# EAGLE schematic main (EAGLE 6.1), part 1 of 2
DATABASE: ./bom/volat3-PARTSDB.tsv
Assembly variants: oblick

## Sheet 1 of 11: mcu
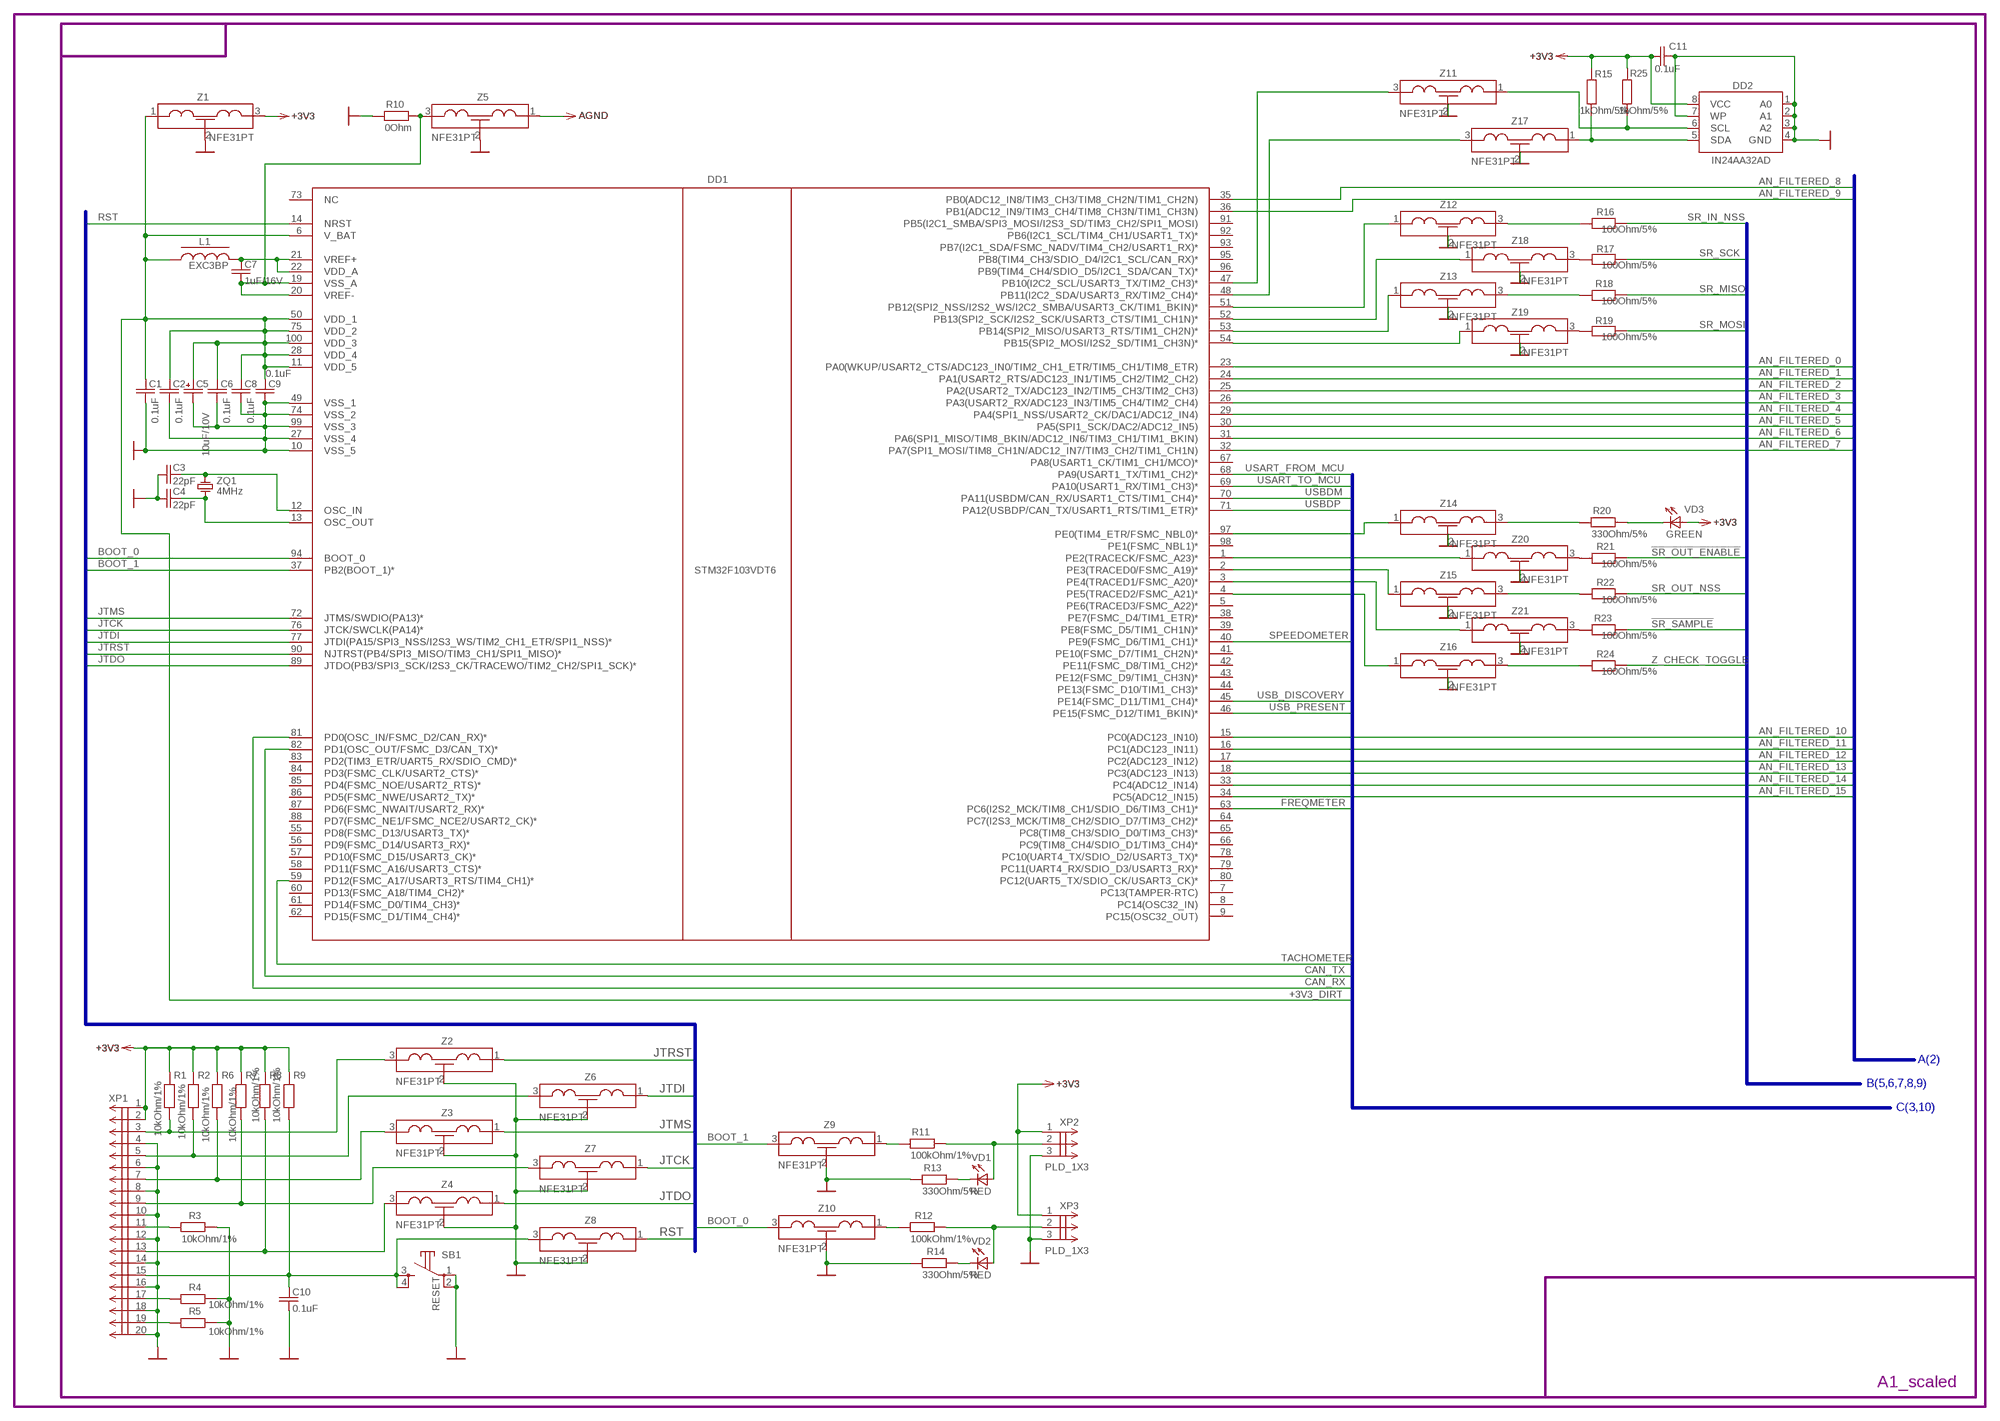
[diagram p0: schematic, sheet 1]

### Parts
C1  0.1uF  C-EUC0603  [C0603]
C2  0.1uF  C-EUC0603  [C0603]
C3  22pF  C-EUC0603  [C0603]
C4  22pF  C-EUC0603  [C0603]
C5  10uF/10V  CPOL-EUA/3216-18W  [A/3216-18W]
C6  0.1uF  C-EUC0603  [C0603]
C7  1uF/16V  C-EUC0603  [C0603]
C8  0.1uF  C-EUC0603  [C0603]
C9  0.1uF  C-EUC0603  [C0603]
C10  0.1uF  C-EUC0603  [C0603]
C11  0.1uF  C-EUC0603  [C0603]
DD1  STM32F103VDT6  [TQFP100]
DD2  IN24AA32AD  [SO08]
L1  EXC3BP  [L0603]
R1  10kOhm/1%  R-EU_R0603  [R0603]
R2  10kOhm/1%  R-EU_R0603  [R0603]
R3  10kOhm/1%  R-EU_R0603  [R0603]
R4  10kOhm/1%  R-EU_R0603  [R0603]
R5  10kOhm/1%  R-EU_R0603  [R0603]
R6  10kOhm/1%  R-EU_R0603  [R0603]
R7  10kOhm/1%  R-EU_R0603  [R0603]
R8  10kOhm/1%  R-EU_R0603  [R0603]
R9  10kOhm/1%  R-EU_R0603  [R0603]
R10  0Ohm  R-EU_R0805  [R0805]
R11  100kOhm/1%  R-EU_R0603  [R0603]
R12  100kOhm/1%  R-EU_R0603  [R0603]
R13  330Ohm/5%  R-EU_R0603  [R0603]
R14  330Ohm/5%  R-EU_R0603  [R0603]
R15  1kOhm/5%  R-EU_R0805  [R0805]
R16  100Ohm/5%  R-EU_R0603  [R0603]
R17  100Ohm/5%  R-EU_R0603  [R0603]
R18  100Ohm/5%  R-EU_R0603  [R0603]
R19  100Ohm/5%  R-EU_R0603  [R0603]
R20  330Ohm/5%  R-EU_R0603  [R0603]
R21  100Ohm/5%  R-EU_R0603  [R0603]
R22  100Ohm/5%  R-EU_R0603  [R0603]
R23  100Ohm/5%  R-EU_R0603  [R0603]
R24  100Ohm/5%  R-EU_R0603  [R0603]
R25  1kOhm/5%  R-EU_R0805  [R0805]
SB1  RESET  4-1437565-2  [B3S-10XX]
VD1  RED  LED0805  [LED-0805]
VD2  RED  LED0805  [LED-0805]
VD3  GREEN  LED0805  [LED-0805]
XP1  PLD_2X10-SHROUDED  [PLD_2X10_SHROUDED]
XP2  PLD_1X3  PLD_1X03  [PLD_1X03]
XP3  PLD_1X3  PLD_1X03  [PLD_1X03]
Z1  NFE31PT  [NFE31]
Z2  NFE31PT  [NFE31]
Z3  NFE31PT  [NFE31]
Z4  NFE31PT  [NFE31]
Z5  NFE31PT  [NFE31]
Z6  NFE31PT  [NFE31]
Z7  NFE31PT  [NFE31]
Z8  NFE31PT  [NFE31]
Z9  NFE31PT  [NFE31]
Z10  NFE31PT  [NFE31]
Z11  NFE31PT  [NFE31]
Z12  NFE31PT  [NFE31]
Z13  NFE31PT  [NFE31]
Z14  NFE31PT  [NFE31]
Z15  NFE31PT  [NFE31]
Z16  NFE31PT  [NFE31]
Z17  NFE31PT  [NFE31]
Z18  NFE31PT  [NFE31]
Z19  NFE31PT  [NFE31]
Z20  NFE31PT  [NFE31]
Z21  NFE31PT  [NFE31]
ZQ1  4MHz  CRYSTALHC49UV  [HC49U-V]

### Nets
!SR_OUT_ENABLE: R21.1 ; also sheet 9
!SR_SAMPLE: R23.1 ; also sheet 5,6,7,8
+3V3: C11.2 DD2.8(VCC) R1.2 R2.2 R6.2 R7.2 R8.2 R9.2 R15.1 R25.1 VD3.A XP1.1 XP1.2 XP2.1 XP3.1 Z1.3 ; also sheet 4,5,6,7,8,9,10
+3V3_DIRT: C1.1 C2.1 C5.+ C6.1 C8.1 C9.1 DD1.6(V_BAT) DD1.11(VDD_5) DD1.28(VDD_4) DD1.50(VDD_1) DD1.75(VDD_2) DD1.100(VDD_3) L1.1 Z1.1 ; also sheet 10
AGND: Z5.1 ; also sheet 2
AN_FILTERED_0: DD1.23(PA0(WKUP/USART2_CTS/ADC123_IN0/TIM2_CH1_ETR/TIM5_CH1/TIM8_ETR)) ; also sheet 2
AN_FILTERED_1: DD1.24(PA1(USART2_RTS/ADC123_IN1/TIM5_CH2/TIM2_CH2)) ; also sheet 2
AN_FILTERED_2: DD1.25(PA2(USART2_TX/ADC123_IN2/TIM5_CH3/TIM2_CH3)) ; also sheet 2
AN_FILTERED_3: DD1.26(PA3(USART2_RX/ADC123_IN3/TIM5_CH4/TIM2_CH4)) ; also sheet 2
AN_FILTERED_4: DD1.29(PA4(SPI1_NSS/USART2_CK/DAC1/ADC12_IN4)) ; also sheet 2
AN_FILTERED_5: DD1.30(PA5(SPI1_SCK/DAC2/ADC12_IN5)) ; also sheet 2
AN_FILTERED_6: DD1.31(PA6(SPI1_MISO/TIM8_BKIN/ADC12_IN6/TIM3_CH1/TIM1_BKIN)) ; also sheet 2
AN_FILTERED_7: DD1.32(PA7(SPI1_MOSI/TIM8_CH1N/ADC12_IN7/TIM3_CH2/TIM1_CH1N)) ; also sheet 2
AN_FILTERED_8: DD1.35(PB0(ADC12_IN8/TIM3_CH3/TIM8_CH2N/TIM1_CH2N)) ; also sheet 2
AN_FILTERED_9: DD1.36(PB1(ADC12_IN9/TIM3_CH4/TIM8_CH3N/TIM1_CH3N)) ; also sheet 2
AN_FILTERED_10: DD1.15(PC0(ADC123_IN10)) ; also sheet 2
AN_FILTERED_11: DD1.16(PC1(ADC123_IN11)) ; also sheet 2
AN_FILTERED_12: DD1.17(PC2(ADC123_IN12)) ; also sheet 2
AN_FILTERED_13: DD1.18(PC3(ADC123_IN13)) ; also sheet 2
AN_FILTERED_14: DD1.33(PC4(ADC12_IN14)) ; also sheet 2
AN_FILTERED_15: DD1.34(PC5(ADC12_IN15)) ; also sheet 2
BOOT_0: DD1.94(BOOT_0) Z10.3
BOOT_1: DD1.37(PB2(BOOT_1)*) Z9.3
CAN_RX: DD1.81(PD0(OSC_IN/FSMC_D2/CAN_RX)*) ; also sheet 10
CAN_TX: DD1.82(PD1(OSC_OUT/FSMC_D3/CAN_TX)*) ; also sheet 10
FREQMETER: DD1.63(PC6(I2S2_MCK/TIM8_CH1/SDIO_D6/TIM3_CH1)*) ; also sheet 3
GND: C1.2 C2.2 C3.2 C4.2 C5.- C6.2 C8.2 C9.2 C10.2 C11.1 DD1.10(VSS_5) DD1.27(VSS_4) DD1.49(VSS_1) DD1.74(VSS_2) DD1.99(VSS_3) DD2.1(A0) DD2.2(A1) DD2.3(A2) DD2.4(GND) DD2.7(WP) R3.2 R4.2 R5.2 R10.1 R13.1 R14.1 SB1.1 SB1.2 XP1.4 XP1.6 XP1.8 XP1.10 XP1.12 XP1.14 XP1.16 XP1.18 XP1.20 XP2.3 XP3.3 Z1.2 Z2.2 Z3.2 Z4.2 Z5.2 Z6.2 Z7.2 Z8.2 Z9.2 Z10.2 Z11.2 Z12.2 Z13.2 Z14.2 Z15.2 Z16.2 Z17.2 Z18.2 Z19.2 Z20.2 Z21.2 ; also sheet 2,3,4,5,6,7,8,9,10
I2C_SCL: DD1.47(PB10(I2C2_SCL/USART3_TX/TIM2_CH3)*) Z11.3
I2C_SDA: DD2.5(SDA) R15.2 Z17.1
JTCK: DD1.76(JTCK/SWCLK(PA14)*) Z7.1
JTDI: DD1.77(JTDI(PA15/SPI3_NSS/I2S3_WS/TIM2_CH1_ETR/SPI1_NSS)*) Z6.1
JTDO: DD1.89(JTDO(PB3/SPI3_SCK/I2S3_CK/TRACEWO/TIM2_CH2/SPI1_SCK)*) Z4.1
JTMS: DD1.72(JTMS/SWDIO(PA13)*) Z3.1
JTRST: DD1.90(NJTRST(PB4/SPI3_MISO/TIM3_CH1/SPI1_MISO)*) Z2.1
N$12: R5.1 XP1.19
N$13: R4.1 XP1.17
N$14: C4.1 DD1.13(OSC_OUT) ZQ1.1
N$15: C3.1 DD1.12(OSC_IN) ZQ1.2
N$16: DD1.51(PB12(SPI2_NSS/I2S2_WS/I2C2_SMBA/USART3_CK/TIM1_BKIN)*) Z12.1
N$17: R3.1 XP1.11
N$18: R12.2 VD2.A XP3.2
N$19: R11.2 VD1.A XP2.2
N$20: R13.2 VD1.C
N$220: DD1.52(PB13(SPI2_SCK/I2S2_SCK/USART3_CTS/TIM1_CH1N)*) Z18.1
N$221: DD1.53(PB14(SPI2_MISO/USART3_RTS/TIM1_CH2N)*) Z13.1
N$222: DD1.54(PB15(SPI2_MOSI/I2S2_SD/TIM1_CH3N)*) Z19.1
N$223: DD1.1(PE2(TRACECK/FSMC_A23)*) Z20.1
N$226: C7.1 DD1.21(VREF+) DD1.22(VDD_A) L1.2
N$232: R14.2 VD2.C
N$268: R20.2 VD3.C
N$272: R20.1 Z14.3
N$275: DD1.2(PE3(TRACED0/FSMC_A19)*) Z15.1
N$276: DD1.3(PE4(TRACED1/FSMC_A20)*) Z21.1
N$277: DD1.4(PE5(TRACED2/FSMC_A21)*) Z16.1
N$331: C7.2 DD1.19(VSS_A) DD1.20(VREF-) R10.2 Z5.3
N$332: R12.1 Z10.1
N$333: R11.1 Z9.1
N$334: R1.1 XP1.3 Z2.3
N$335: R2.1 XP1.5 Z6.3
N$336: R6.1 XP1.7 Z3.3
N$337: C10.1 R9.1 SB1.3 SB1.4 XP1.15 Z8.3
N$338: R7.1 XP1.9 Z7.3
N$339: R8.1 XP1.13 Z4.3
N$340: DD1.48(PB11(I2C2_SDA/USART3_RX/TIM2_CH4)*) Z17.3
N$341: DD2.6(SCL) R25.2 Z11.1
N$350: DD1.97(PE0(TIM4_ETR/FSMC_NBL0)*) Z14.1
N$351: R21.2 Z20.3
N$352: R22.2 Z15.3
N$353: R23.2 Z21.3
N$354: R24.2 Z16.3
N$355: R16.2 Z12.3
N$356: R18.2 Z13.3
N$357: R17.2 Z18.3
N$358: R19.2 Z19.3
RST: DD1.14(NRST) Z8.1
SPEEDOMETER: DD1.40(PE9(FSMC_D6/TIM1_CH1)*) ; also sheet 3
SR_IN_NSS: R16.1 ; also sheet 5,6,7,8
SR_MISO: R18.1 ; also sheet 8
SR_MOSI: R19.1 ; also sheet 9
SR_OUT_NSS: R22.1 ; also sheet 9
SR_SCK: R17.1 ; also sheet 5,6,7,8,9
TACHOMETER: DD1.59(PD12(FSMC_A17/USART3_RTS/TIM4_CH1)*) ; also sheet 3
USART_FROM_MCU: DD1.68(PA9(USART1_TX/TIM1_CH2)*) ; also sheet 10
USART_TO_MCU: DD1.69(PA10(USART1_RX/TIM1_CH3)*) ; also sheet 10
USB_DISCOVERY: DD1.45(PE14(FSMC_D11/TIM1_CH4)*) ; also sheet 10
USB_PRESENT: DD1.46(PE15(FSMC_D12/TIM1_BKIN)*) ; also sheet 10
USBDM: DD1.70(PA11(USBDM/CAN_RX/USART1_CTS/TIM1_CH4)*) ; also sheet 10
USBDP: DD1.71(PA12(USBDP/CAN_TX/USART1_RTS/TIM1_ETR)*) ; also sheet 10
Z_CHECK_TOGGLE: R24.1 ; also sheet 5
Unconnected: DD1.5(PE6(TRACED3/FSMC_A22)*) DD1.7(PC13(TAMPER-RTC)) DD1.8(PC14(OSC32_IN)) DD1.9(PC15(OSC32_OUT)) DD1.38(PE7(FSMC_D4/TIM1_ETR)*) DD1.39(PE8(FSMC_D5/TIM1_CH1N)*) DD1.41(PE10(FSMC_D7/TIM1_CH2N)*) DD1.42(PE11(FSMC_D8/TIM1_CH2)*) DD1.43(PE12(FSMC_D9/TIM1_CH3N)*) DD1.44(PE13(FSMC_D10/TIM1_CH3)*) DD1.55(PD8(FSMC_D13/USART3_TX)*) DD1.56(PD9(FSMC_D14/USART3_RX)*) DD1.57(PD10(FSMC_D15/USART3_CK)*) DD1.58(PD11(FSMC_A16/USART3_CTS)*) DD1.60(PD13(FSMC_A18/TIM4_CH2)*) DD1.61(PD14(FSMC_D0/TIM4_CH3)*) DD1.62(PD15(FSMC_D1/TIM4_CH4)*) DD1.64(PC7(I2S3_MCK/TIM8_CH2/SDIO_D7/TIM3_CH2)*) DD1.65(PC8(TIM8_CH3/SDIO_D0/TIM3_CH3)*) DD1.66(PC9(TIM8_CH4/SDIO_D1/TIM3_CH4)*) DD1.67(PA8(USART1_CK/TIM1_CH1/MCO)*) DD1.73(NC) DD1.78(PC10(UART4_TX/SDIO_D2/USART3_TX)*) DD1.79(PC11(UART4_RX/SDIO_D3/USART3_RX)*) DD1.80(PC12(UART5_TX/SDIO_CK/USART3_CK)*) DD1.83(PD2(TIM3_ETR/UART5_RX/SDIO_CMD)*) DD1.84(PD3(FSMC_CLK/USART2_CTS)*) DD1.85(PD4(FSMC_NOE/USART2_RTS)*) DD1.86(PD5(FSMC_NWE/USART2_TX)*) DD1.87(PD6(FSMC_NWAIT/USART2_RX)*) DD1.88(PD7(FSMC_NE1/FSMC_NCE2/USART2_CK)*) DD1.91(PB5(I2C1_SMBA/SPI3_MOSI/I2S3_SD/TIM3_CH2/SPI1_MOSI)) DD1.92(PB6(I2C1_SCL/TIM4_CH1/USART1_TX)*) DD1.93(PB7(I2C1_SDA/FSMC_NADV/TIM4_CH2/USART1_RX)*) DD1.95(PB8(TIM4_CH3/SDIO_D4/I2C1_SCL/CAN_RX)*) DD1.96(PB9(TIM4_CH4/SDIO_D5/I2C1_SDA/CAN_TX)*) DD1.98(PE1(FSMC_NBL1)*)

### Buses
AN_FILTERED_[0..15]
IO_EXPAND:SR_MISO,SR_MOSI,SR_SCK,!SR_SAMPLE,SR_IN_NSS,SR_OUT_NSS,!SR_OUT_ENABLE,SR_OUT_[1..7],Z_CHECK_TOGGLE,Z_CHECK
TACHOMETER,FREQMETER,SPEEDOMETER,USB_DISCOVERY,USB_PRESENT,USBDP,USBDM,USART_FROM_MCU,USART_TO_MCU,CAN_TX,CAN_RX,+3V3_DIRT
JTRST,JTDI,JTMS,JTCK,JTDO,RST,BOOT_0,BOOT_1

### Notes on the sheet
- A(2)
- B(5,6,7,8,9)
- C(3,10)

## Sheet 2 of 11: analog
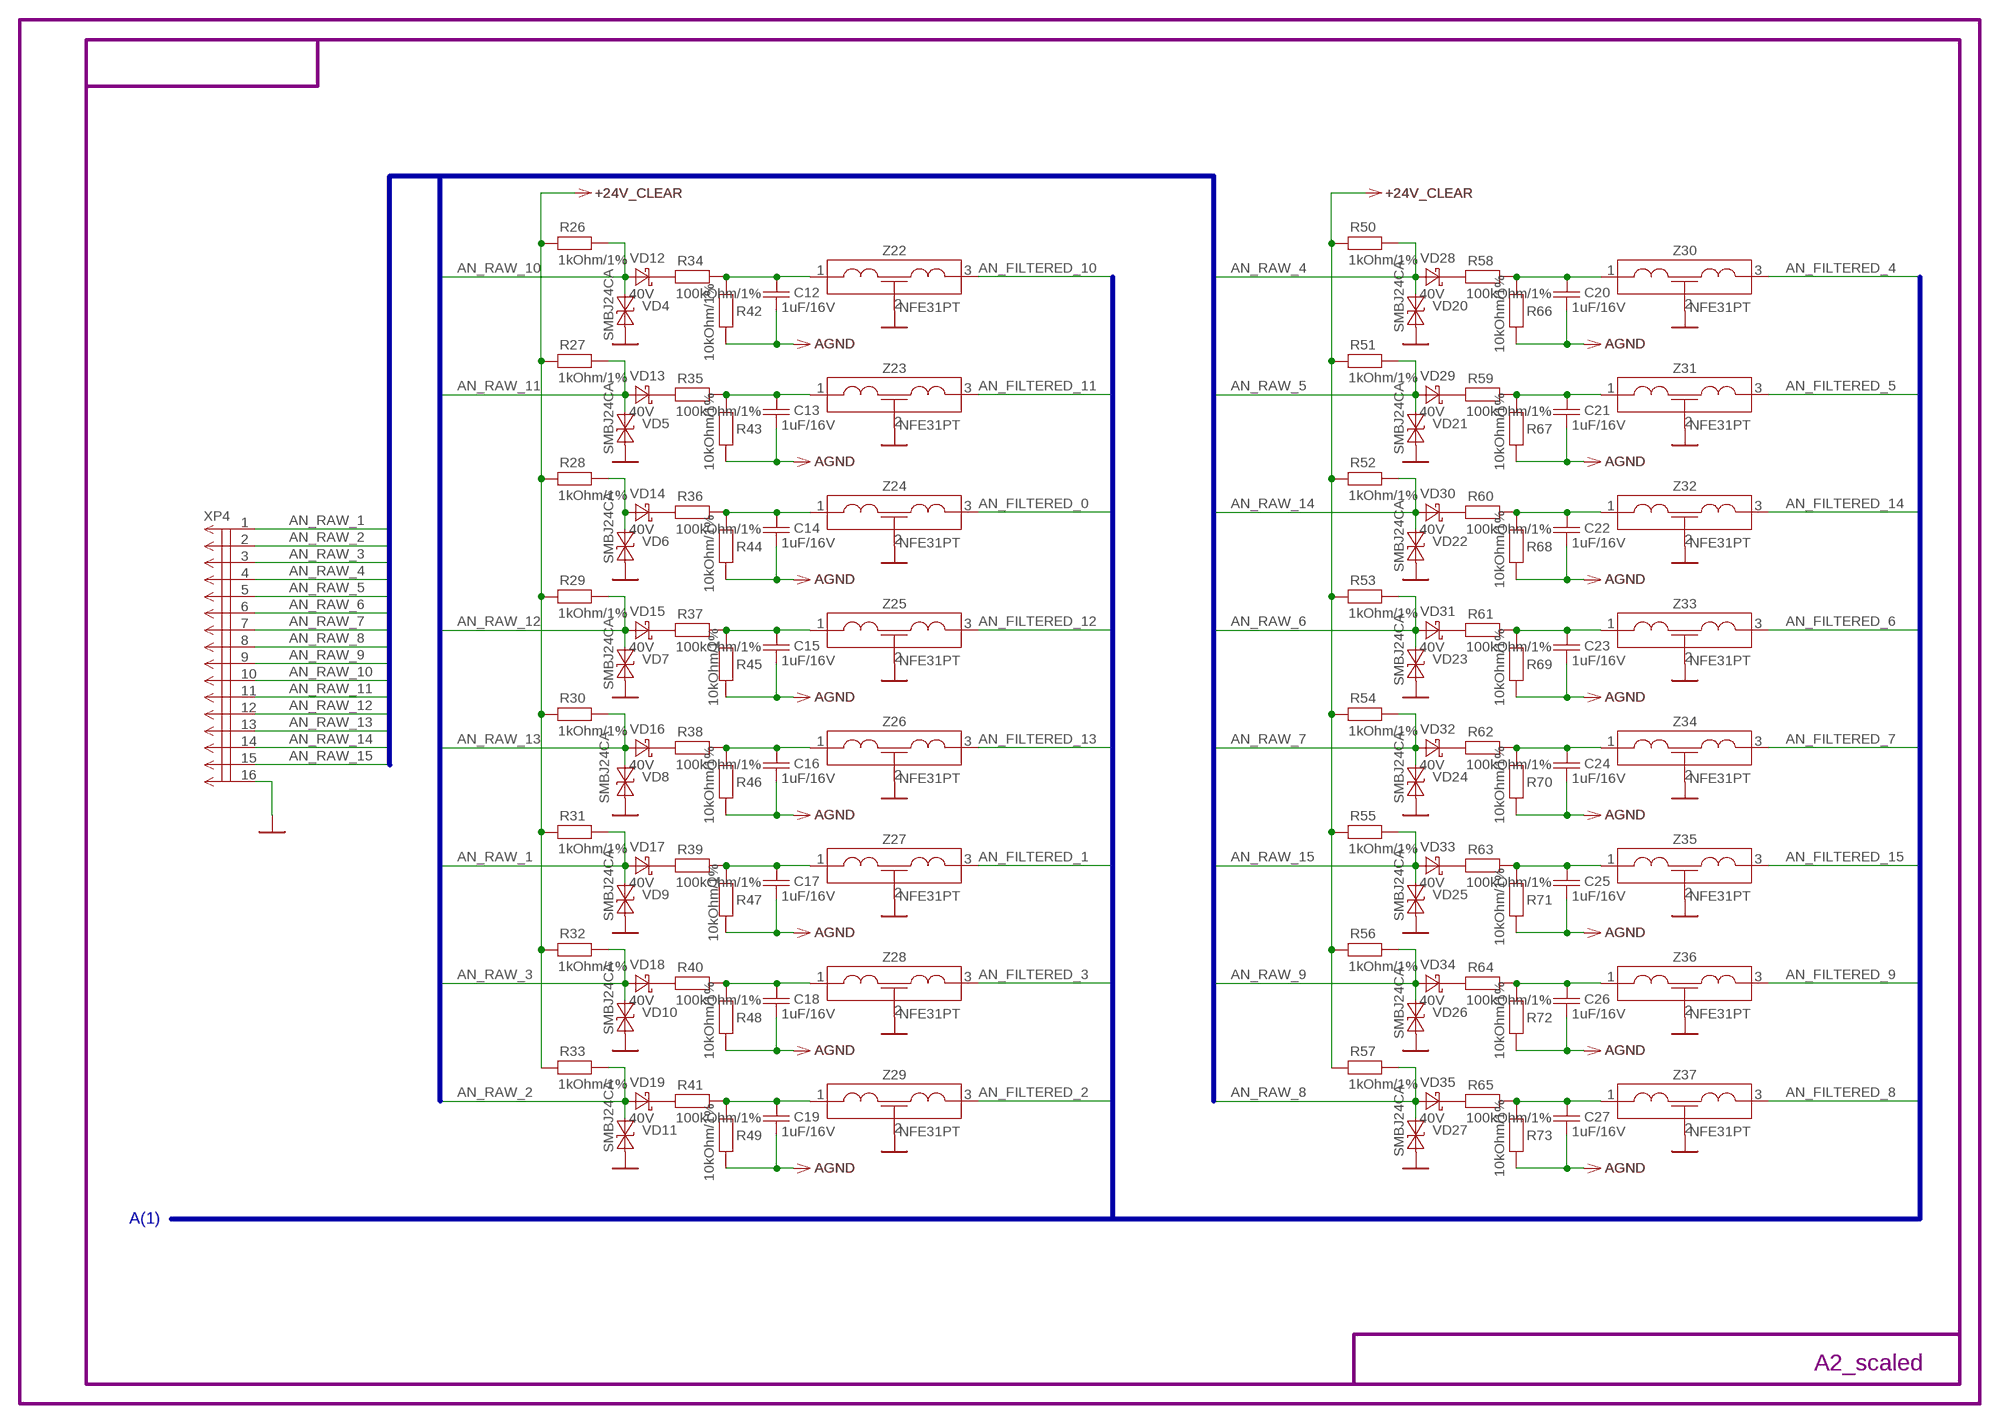
[diagram p1: schematic, sheet 2]

### Parts
C12  1uF/16V  C-EUC0603  [C0603]
C13  1uF/16V  C-EUC0603  [C0603]
C14  1uF/16V  C-EUC0603  [C0603]
C15  1uF/16V  C-EUC0603  [C0603]
C16  1uF/16V  C-EUC0603  [C0603]
C17  1uF/16V  C-EUC0603  [C0603]
C18  1uF/16V  C-EUC0603  [C0603]
C19  1uF/16V  C-EUC0603  [C0603]
C20  1uF/16V  C-EUC0603  [C0603]
C21  1uF/16V  C-EUC0603  [C0603]
C22  1uF/16V  C-EUC0603  [C0603]
C23  1uF/16V  C-EUC0603  [C0603]
C24  1uF/16V  C-EUC0603  [C0603]
C25  1uF/16V  C-EUC0603  [C0603]
C26  1uF/16V  C-EUC0603  [C0603]
C27  1uF/16V  C-EUC0603  [C0603]
R26  1kOhm/1%  R-EU_R2512  [R2512]
R27  1kOhm/1%  R-EU_R2512  [R2512]
R28  1kOhm/1%  R-EU_R2512  [R2512]
R29  1kOhm/1%  R-EU_R2512  [R2512]
R30  1kOhm/1%  R-EU_R2512  [R2512]
R31  1kOhm/1%  R-EU_R2512  [R2512]
R32  1kOhm/1%  R-EU_R2512  [R2512]
R33  1kOhm/1%  R-EU_R2512  [R2512]
R34  100kOhm/1%  R-EU_R0603  [R0603]
R35  100kOhm/1%  R-EU_R0603  [R0603]
R36  100kOhm/1%  R-EU_R0603  [R0603]
R37  100kOhm/1%  R-EU_R0603  [R0603]
R38  100kOhm/1%  R-EU_R0603  [R0603]
R39  100kOhm/1%  R-EU_R0603  [R0603]
R40  100kOhm/1%  R-EU_R0603  [R0603]
R41  100kOhm/1%  R-EU_R0603  [R0603]
R42  10kOhm/1%  R-EU_R0603  [R0603]
R43  10kOhm/1%  R-EU_R0603  [R0603]
R44  10kOhm/1%  R-EU_R0603  [R0603]
R45  10kOhm/1%  R-EU_R0603  [R0603]
R46  10kOhm/1%  R-EU_R0603  [R0603]
R47  10kOhm/1%  R-EU_R0603  [R0603]
R48  10kOhm/1%  R-EU_R0603  [R0603]
R49  10kOhm/1%  R-EU_R0603  [R0603]
R50  1kOhm/1%  R-EU_R2512  [R2512]
R51  1kOhm/1%  R-EU_R2512  [R2512]
R52  1kOhm/1%  R-EU_R2512  [R2512]
R53  1kOhm/1%  R-EU_R2512  [R2512]
R54  1kOhm/1%  R-EU_R2512  [R2512]
R55  1kOhm/1%  R-EU_R2512  [R2512]
R56  1kOhm/1%  R-EU_R2512  [R2512]
R57  1kOhm/1%  R-EU_R2512  [R2512]
R58  100kOhm/1%  R-EU_R0603  [R0603]
R59  100kOhm/1%  R-EU_R0603  [R0603]
R60  100kOhm/1%  R-EU_R0603  [R0603]
R61  100kOhm/1%  R-EU_R0603  [R0603]
R62  100kOhm/1%  R-EU_R0603  [R0603]
R63  100kOhm/1%  R-EU_R0603  [R0603]
R64  100kOhm/1%  R-EU_R0603  [R0603]
R65  100kOhm/1%  R-EU_R0603  [R0603]
R66  10kOhm/1%  R-EU_R0603  [R0603]
R67  10kOhm/1%  R-EU_R0603  [R0603]
R68  10kOhm/1%  R-EU_R0603  [R0603]
R69  10kOhm/1%  R-EU_R0603  [R0603]
R70  10kOhm/1%  R-EU_R0603  [R0603]
R71  10kOhm/1%  R-EU_R0603  [R0603]
R72  10kOhm/1%  R-EU_R0603  [R0603]
R73  10kOhm/1%  R-EU_R0603  [R0603]
VD4  SMBJ24CA  DIODE-TVS-BIDIR-SMB  [SMB-BIDIR]
VD5  SMBJ24CA  DIODE-TVS-BIDIR-SMB  [SMB-BIDIR]
VD6  SMBJ24CA  DIODE-TVS-BIDIR-SMB  [SMB-BIDIR]
VD7  SMBJ24CA  DIODE-TVS-BIDIR-SMB  [SMB-BIDIR]
VD8  SMBJ24CA  DIODE-TVS-BIDIR-SMB  [SMB-BIDIR]
VD9  SMBJ24CA  DIODE-TVS-BIDIR-SMB  [SMB-BIDIR]
VD10  SMBJ24CA  DIODE-TVS-BIDIR-SMB  [SMB-BIDIR]
VD11  SMBJ24CA  DIODE-TVS-BIDIR-SMB  [SMB-BIDIR]
VD12  40V  DIODE-SCHOTTKY-SOD323  [SOD323]
VD13  40V  DIODE-SCHOTTKY-SOD323  [SOD323]
VD14  40V  DIODE-SCHOTTKY-SOD323  [SOD323]
VD15  40V  DIODE-SCHOTTKY-SOD323  [SOD323]
VD16  40V  DIODE-SCHOTTKY-SOD323  [SOD323]
VD17  40V  DIODE-SCHOTTKY-SOD323  [SOD323]
VD18  40V  DIODE-SCHOTTKY-SOD323  [SOD323]
VD19  40V  DIODE-SCHOTTKY-SOD323  [SOD323]
VD20  SMBJ24CA  DIODE-TVS-BIDIR-SMB  [SMB-BIDIR]
VD21  SMBJ24CA  DIODE-TVS-BIDIR-SMB  [SMB-BIDIR]
VD22  SMBJ24CA  DIODE-TVS-BIDIR-SMB  [SMB-BIDIR]
VD23  SMBJ24CA  DIODE-TVS-BIDIR-SMB  [SMB-BIDIR]
VD24  SMBJ24CA  DIODE-TVS-BIDIR-SMB  [SMB-BIDIR]
VD25  SMBJ24CA  DIODE-TVS-BIDIR-SMB  [SMB-BIDIR]
VD26  SMBJ24CA  DIODE-TVS-BIDIR-SMB  [SMB-BIDIR]
VD27  SMBJ24CA  DIODE-TVS-BIDIR-SMB  [SMB-BIDIR]
VD28  40V  DIODE-SCHOTTKY-SOD323  [SOD323]
VD29  40V  DIODE-SCHOTTKY-SOD323  [SOD323]
VD30  40V  DIODE-SCHOTTKY-SOD323  [SOD323]
VD31  40V  DIODE-SCHOTTKY-SOD323  [SOD323]
VD32  40V  DIODE-SCHOTTKY-SOD323  [SOD323]
VD33  40V  DIODE-SCHOTTKY-SOD323  [SOD323]
VD34  40V  DIODE-SCHOTTKY-SOD323  [SOD323]
VD35  40V  DIODE-SCHOTTKY-SOD323  [SOD323]
XP4  MOLEX-90130-16  [MOLEX-90130-16]
Z22  NFE31PT  [NFE31]
Z23  NFE31PT  [NFE31]
Z24  NFE31PT  [NFE31]
Z25  NFE31PT  [NFE31]
Z26  NFE31PT  [NFE31]
Z27  NFE31PT  [NFE31]
Z28  NFE31PT  [NFE31]
Z29  NFE31PT  [NFE31]
Z30  NFE31PT  [NFE31]
Z31  NFE31PT  [NFE31]
Z32  NFE31PT  [NFE31]
Z33  NFE31PT  [NFE31]
Z34  NFE31PT  [NFE31]
Z35  NFE31PT  [NFE31]
Z36  NFE31PT  [NFE31]
Z37  NFE31PT  [NFE31]

### Nets
+24V_CLEAR: R26.1 R27.1 R28.1 R29.1 R30.1 R31.1 R32.1 R33.1 R50.1 R51.1 R52.1 R53.1 R54.1 R55.1 R56.1 R57.1 ; also sheet 4,5
AGND: C12.2 C13.2 C14.2 C15.2 C16.2 C17.2 C18.2 C19.2 C20.2 C21.2 C22.2 C23.2 C24.2 C25.2 C26.2 C27.2 R42.1 R43.1 R44.1 R45.1 R46.1 R47.1 R48.1 R49.1 R66.1 R67.1 R68.1 R69.1 R70.1 R71.1 R72.1 R73.1 ; also sheet 1
AN_FILTERED_0: Z24.3 ; also sheet 1
AN_FILTERED_1: Z27.3 ; also sheet 1
AN_FILTERED_2: Z29.3 ; also sheet 1
AN_FILTERED_3: Z28.3 ; also sheet 1
AN_FILTERED_4: Z30.3 ; also sheet 1
AN_FILTERED_5: Z31.3 ; also sheet 1
AN_FILTERED_6: Z33.3 ; also sheet 1
AN_FILTERED_7: Z34.3 ; also sheet 1
AN_FILTERED_8: Z37.3 ; also sheet 1
AN_FILTERED_9: Z36.3 ; also sheet 1
AN_FILTERED_10: Z22.3 ; also sheet 1
AN_FILTERED_11: Z23.3 ; also sheet 1
AN_FILTERED_12: Z25.3 ; also sheet 1
AN_FILTERED_13: Z26.3 ; also sheet 1
AN_FILTERED_14: Z32.3 ; also sheet 1
AN_FILTERED_15: Z35.3 ; also sheet 1
AN_RAW_1: R31.2 VD9.A1 VD17.A XP4.1
AN_RAW_2: R33.2 VD11.A1 VD19.A XP4.2
AN_RAW_2_SUPPLY: R28.2 VD6.A1 VD14.A
AN_RAW_3: R32.2 VD10.A1 VD18.A XP4.3
AN_RAW_4: R50.2 VD20.A1 VD28.A XP4.4
AN_RAW_5: R51.2 VD21.A1 VD29.A XP4.5
AN_RAW_6: R53.2 VD23.A1 VD31.A XP4.6
AN_RAW_7: R54.2 VD24.A1 VD32.A XP4.7
AN_RAW_8: R57.2 VD27.A1 VD35.A XP4.8
AN_RAW_9: R56.2 VD26.A1 VD34.A XP4.9
AN_RAW_10: R26.2 VD4.A1 VD12.A XP4.10
AN_RAW_11: R27.2 VD5.A1 VD13.A XP4.11
AN_RAW_12: R29.2 VD7.A1 VD15.A XP4.12
AN_RAW_13: R30.2 VD8.A1 VD16.A XP4.13
AN_RAW_14: R52.2 VD22.A1 VD30.A XP4.14
AN_RAW_15: R55.2 VD25.A1 VD33.A XP4.15
GND: VD4.A2 VD5.A2 VD6.A2 VD7.A2 VD8.A2 VD9.A2 VD10.A2 VD11.A2 VD20.A2 VD21.A2 VD22.A2 VD23.A2 VD24.A2 VD25.A2 VD26.A2 VD27.A2 XP4.16 Z22.2 Z23.2 Z24.2 Z25.2 Z26.2 Z27.2 Z28.2 Z29.2 Z30.2 Z31.2 Z32.2 Z33.2 Z34.2 Z35.2 Z36.2 Z37.2 ; also sheet 1,3,4,5,6,7,8,9,10
N$30: R34.1 VD12.C
N$31: R35.1 VD13.C
N$32: R41.1 VD19.C
N$33: R40.1 VD18.C
N$34: R39.1 VD17.C
N$35: R38.1 VD16.C
N$36: R37.1 VD15.C
N$37: R36.1 VD14.C
N$38: R58.1 VD28.C
N$39: R60.1 VD30.C
N$40: R59.1 VD29.C
N$41: R61.1 VD31.C
N$42: R62.1 VD32.C
N$43: R64.1 VD34.C
N$44: R63.1 VD33.C
N$45: R65.1 VD35.C
N$315: C12.1 R34.2 R42.2 Z22.1
N$316: C13.1 R35.2 R43.2 Z23.1
N$317: C14.1 R36.2 R44.2 Z24.1
N$318: C15.1 R37.2 R45.2 Z25.1
N$319: C16.1 R38.2 R46.2 Z26.1
N$320: C17.1 R39.2 R47.2 Z27.1
N$321: C18.1 R40.2 R48.2 Z28.1
N$322: C19.1 R41.2 R49.2 Z29.1
N$323: C20.1 R58.2 R66.2 Z30.1
N$324: C21.1 R59.2 R67.2 Z31.1
N$325: C22.1 R60.2 R68.2 Z32.1
N$326: C23.1 R61.2 R69.2 Z33.1
N$327: C24.1 R62.2 R70.2 Z34.1
N$328: C25.1 R63.2 R71.2 Z35.1
N$329: C26.1 R64.2 R72.2 Z36.1
N$330: C27.1 R65.2 R73.2 Z37.1

### Buses
AN_FILTERED_[0..15]
AN_RAW_[0..15]

### Notes on the sheet
- A(1)

## Sheet 3 of 11: Freq
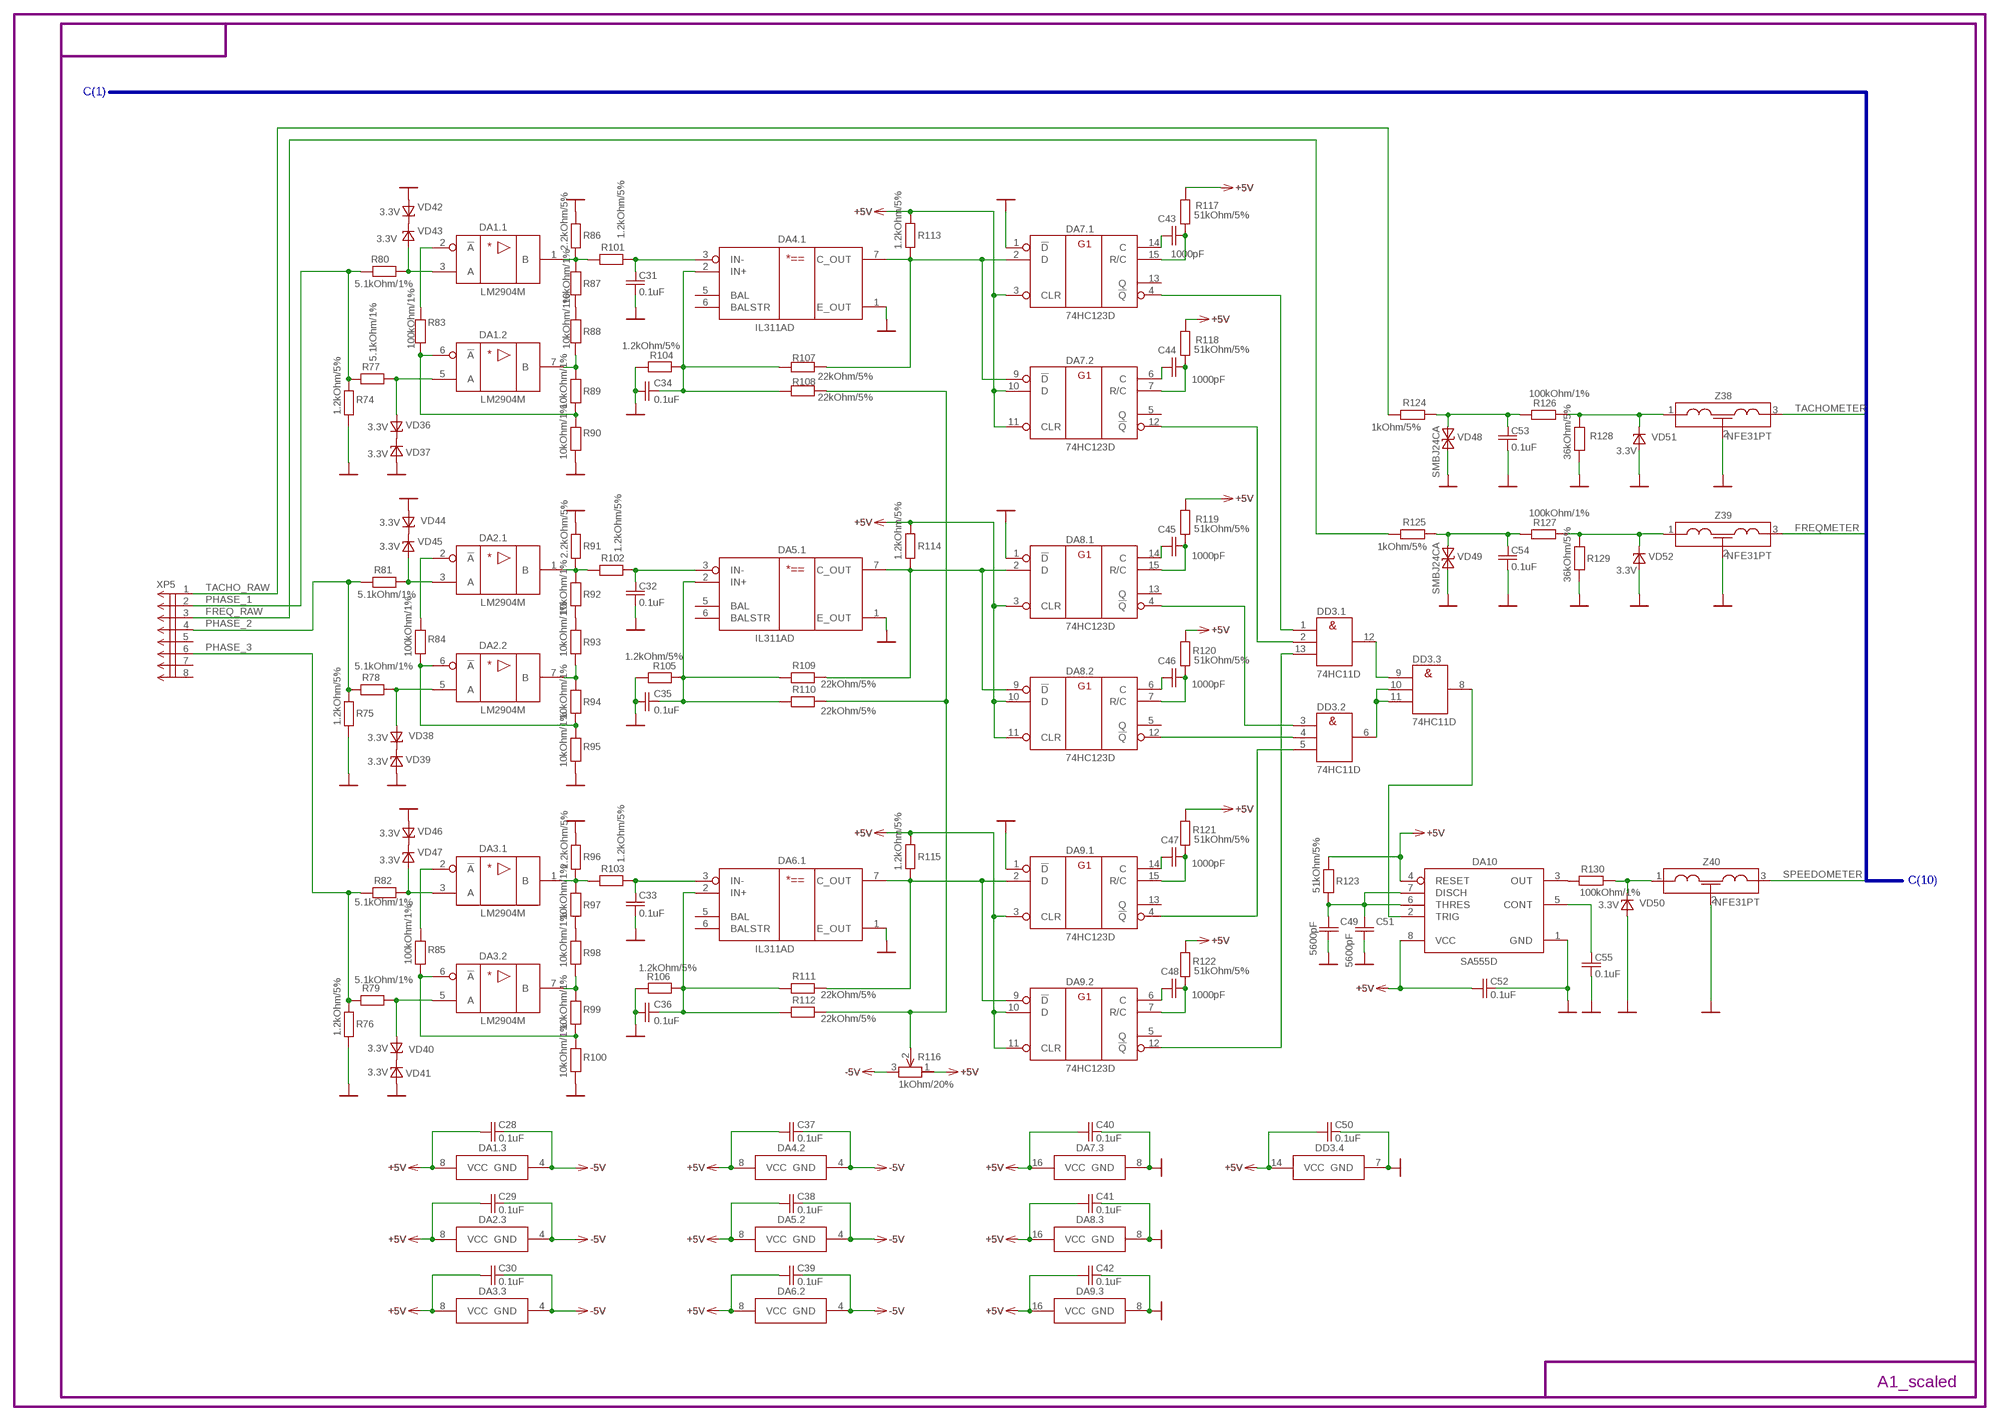
[diagram p2: schematic, sheet 3]

### Parts
C28  0.1uF  C-EUC0603  [C0603]
C29  0.1uF  C-EUC0603  [C0603]
C30  0.1uF  C-EUC0603  [C0603]
C31  0.1uF  C-EUC0603  [C0603]
C32  0.1uF  C-EUC0603  [C0603]
C33  0.1uF  C-EUC0603  [C0603]
C34  0.1uF  C-EUC0603  [C0603]
C35  0.1uF  C-EUC0603  [C0603]
C36  0.1uF  C-EUC0603  [C0603]
C37  0.1uF  C-EUC0603  [C0603]
C38  0.1uF  C-EUC0603  [C0603]
C39  0.1uF  C-EUC0603  [C0603]
C40  0.1uF  C-EUC0603  [C0603]
C41  0.1uF  C-EUC0603  [C0603]
C42  0.1uF  C-EUC0603  [C0603]
C43  1000pF  C-EUC0603  [C0603]
C44  1000pF  C-EUC0603  [C0603]
C45  1000pF  C-EUC0603  [C0603]
C46  1000pF  C-EUC0603  [C0603]
C47  1000pF  C-EUC0603  [C0603]
C48  1000pF  C-EUC0603  [C0603]
C49  5600pF  C-EUC0603  [C0603]
C50  0.1uF  C-EUC0603  [C0603]
C51  5600pF  C-EUC0603  [C0603]
C52  0.1uF  C-EUC0603  [C0603]
C53  0.1uF  C-EUC0603  [C0603]
C54  0.1uF  C-EUC0603  [C0603]
C55  0.1uF  C-EUC0603  [C0603]
DA1  LM2904M  [SO08]
DA2  LM2904M  [SO08]
DA3  LM2904M  [SO08]
DA4  IL311AD  [SO08]
DA5  IL311AD  [SO08]
DA6  IL311AD  [SO08]
DA7  74HC123D  [SO16]
DA8  74HC123D  [SO16]
DA9  74HC123D  [SO16]
DA10  SA555D  [SO08]
DD3  74HC11D  [SO14]
R74  1.2kOhm/5%  R-EU_R0603  [R0603]
R75  1.2kOhm/5%  R-EU_R0603  [R0603]
R76  1.2kOhm/5%  R-EU_R0603  [R0603]
R77  5.1kOhm/1%  R-EU_R0603  [R0603]
R78  5.1kOhm/1%  R-EU_R0603  [R0603]
R79  5.1kOhm/1%  R-EU_R0603  [R0603]
R80  5.1kOhm/1%  R-EU_R0603  [R0603]
R81  5.1kOhm/1%  R-EU_R0603  [R0603]
R82  5.1kOhm/1%  R-EU_R0603  [R0603]
R83  100kOhm/1%  R-EU_R0603  [R0603]
R84  100kOhm/1%  R-EU_R0603  [R0603]
R85  100kOhm/1%  R-EU_R0603  [R0603]
R86  2.2kOhm/5%  R-EU_R0603  [R0603]
R87  10kOhm/1%  R-EU_R0603  [R0603]
R88  10kOhm/1%  R-EU_R0603  [R0603]
R89  10kOhm/1%  R-EU_R0603  [R0603]
R90  10kOhm/1%  R-EU_R0603  [R0603]
R91  2.2kOhm/5%  R-EU_R0603  [R0603]
R92  10kOhm/1%  R-EU_R0603  [R0603]
R93  10kOhm/1%  R-EU_R0603  [R0603]
R94  10kOhm/1%  R-EU_R0603  [R0603]
R95  10kOhm/1%  R-EU_R0603  [R0603]
R96  2.2kOhm/5%  R-EU_R0603  [R0603]
R97  10kOhm/1%  R-EU_R0603  [R0603]
R98  10kOhm/1%  R-EU_R0603  [R0603]
R99  10kOhm/1%  R-EU_R0603  [R0603]
R100  10kOhm/1%  R-EU_R0603  [R0603]
R101  1.2kOhm/5%  R-EU_R0603  [R0603]
R102  1.2kOhm/5%  R-EU_R0603  [R0603]
R103  1.2kOhm/5%  R-EU_R0603  [R0603]
R104  1.2kOhm/5%  R-EU_R0603  [R0603]
R105  1.2kOhm/5%  R-EU_R0603  [R0603]
R106  1.2kOhm/5%  R-EU_R0603  [R0603]
R107  22kOhm/5%  R-EU_R0603  [R0603]
R108  22kOhm/5%  R-EU_R0603  [R0603]
R109  22kOhm/5%  R-EU_R0603  [R0603]
R110  22kOhm/5%  R-EU_R0603  [R0603]
R111  22kOhm/5%  R-EU_R0603  [R0603]
R112  22kOhm/5%  R-EU_R0603  [R0603]
R113  1.2kOhm/5%  R-EU_R0603  [R0603]
R114  1.2kOhm/5%  R-EU_R0603  [R0603]
R115  1.2kOhm/5%  R-EU_R0603  [R0603]
R116  1kOhm/20%  R-TRIMMTSM4YJ  [RTRIMTSM53YJ]
R117  51kOhm/5%  R-EU_R0603  [R0603]
R118  51kOhm/5%  R-EU_R0603  [R0603]
R119  51kOhm/5%  R-EU_R0603  [R0603]
R120  51kOhm/5%  R-EU_R0603  [R0603]
R121  51kOhm/5%  R-EU_R0603  [R0603]
R122  51kOhm/5%  R-EU_R0603  [R0603]
R123  51kOhm/5%  R-EU_R0603  [R0603]
R124  1kOhm/5%  R-EU_R2512  [R2512]
R125  1kOhm/5%  R-EU_R2512  [R2512]
R126  100kOhm/1%  R-EU_R0603  [R0603]
R127  100kOhm/1%  R-EU_R0603  [R0603]
R128  36kOhm/5%  R-EU_R0603  [R0603]
R129  36kOhm/5%  R-EU_R0603  [R0603]
R130  100kOhm/1%  R-EU_R0603  [R0603]
VD36  3.3V  DIODE-ZENER-  [SOD80]
VD37  3.3V  DIODE-ZENER-  [SOD80]
VD38  3.3V  DIODE-ZENER-  [SOD80]
VD39  3.3V  DIODE-ZENER-  [SOD80]
VD40  3.3V  DIODE-ZENER-  [SOD80]
VD41  3.3V  DIODE-ZENER-  [SOD80]
VD42  3.3V  DIODE-ZENER-  [SOD80]
VD43  3.3V  DIODE-ZENER-  [SOD80]
VD44  3.3V  DIODE-ZENER-  [SOD80]
VD45  3.3V  DIODE-ZENER-  [SOD80]
VD46  3.3V  DIODE-ZENER-  [SOD80]
VD47  3.3V  DIODE-ZENER-  [SOD80]
VD48  SMBJ24CA  DIODE-TVS-BIDIR-SMB  [SMB-BIDIR]
VD49  SMBJ24CA  DIODE-TVS-BIDIR-SMB  [SMB-BIDIR]
VD50  3.3V  DIODE-ZENER-  [SOD80]
VD51  3.3V  DIODE-ZENER-  [SOD80]
VD52  3.3V  DIODE-ZENER-  [SOD80]
XP5  MOLEX-90130-08  [MOLEX-90130-08]
Z38  NFE31PT  [NFE31]
Z39  NFE31PT  [NFE31]
Z40  NFE31PT  [NFE31]

### Nets
+5V: C28.1 C29.1 C30.1 C37.1 C38.1 C39.1 C40.1 C41.1 C42.1 C50.1 C52.1 DA1.8(.3:VCC) DA2.8(.3:VCC) DA3.8(.3:VCC) DA4.8(.2:VCC) DA5.8(.2:VCC) DA6.8(.2:VCC) DA7.3(.1:CLR) DA7.10(.2:D) DA7.11(.2:CLR) DA7.16(.3:VCC) DA8.3(.1:CLR) DA8.10(.2:D) DA8.11(.2:CLR) DA8.16(.3:VCC) DA9.3(.1:CLR) DA9.10(.2:D) DA9.11(.2:CLR) DA9.16(.3:VCC) DA10.4(RESET) DA10.8(VCC) DD3.14(.4:VCC) R113.1 R114.1 R115.1 R116.1(A) R117.2 R118.2 R119.2 R120.2 R121.2 R122.2 R123.2 ; also sheet 4
-5V: C28.2 C29.2 C30.2 C37.2 C38.2 C39.2 DA1.4(.3:GND) DA2.4(.3:GND) DA3.4(.3:GND) DA4.4(.2:GND) DA5.4(.2:GND) DA6.4(.2:GND) R116.3(E) ; also sheet 4
FREQ_RAW: R125.2 XP5.3
FREQMETER: Z39.3 ; also sheet 1
GND: C31.1 C32.1 C33.1 C34.2 C35.2 C36.2 C40.2 C41.2 C42.2 C49.2 C50.2 C51.2 C52.2 C53.1 C54.1 C55.2 DA4.1(.1:E_OUT) DA5.1(.1:E_OUT) DA6.1(.1:E_OUT) DA7.1(.1:!D) DA7.8(.3:GND) DA8.1(.1:!D) DA8.8(.3:GND) DA9.1(.1:!D) DA9.8(.3:GND) DA10.1(GND) DD3.7(.4:GND) R74.1 R75.1 R76.1 R86.2 R90.1 R91.2 R95.1 R96.2 R100.1 R104.2 R105.2 R106.2 R128.1 R129.1 VD37.A VD39.A VD41.A VD42.A VD44.A VD46.A VD48.A2 VD49.A2 VD50.A VD51.A VD52.A Z38.2 Z39.2 Z40.2 ; also sheet 1,2,4,5,6,7,8,9,10
N$87: VD44.C VD45.C
N$243: C53.2 R124.1 R126.1 VD48.A1
N$245: DD3.6(.2:Y) DD3.10(.3:B) DD3.11(.3:C)
N$246: DD3.9(.3:A) DD3.12(.1:Y)
N$247: DA10.2(TRIG) DD3.8(.3:Y)
N$248: DA10.3(OUT) R130.1
N$249: C34.1 DA4.2(.1:IN+) R104.1 R107.1 R108.1
N$250: DA4.7(.1:C_OUT) DA7.2(.1:D) DA7.9(.2:!D) R107.2 R113.2
N$251: VD42.C VD43.C
N$252: DA1.3(.1:A) R80.2 VD43.A
N$253: C43.2 DA7.15(.1:R/C) R117.1
N$254: DA2.3(.1:A) R81.2 VD45.A
N$255: VD36.C VD37.C
N$256: DA1.5(.2:A) R77.2 VD36.A
N$257: C43.1 DA7.14(.1:C)
N$258: C44.1 DA7.6(.2:C)
N$259: C31.2 DA4.3(.1:IN-) R101.2
N$260: C44.2 DA7.7(.2:R/C) R118.1
N$261: C49.1 C51.1 DA10.6(THRES) DA10.7(DISCH) R123.1
N$262: DA1.2(.1:!A) R83.2
N$263: DA7.4(.1:!Q) DD3.1(.1:A)
N$264: DA7.12(.2:!Q) DD3.2(.1:B)
N$265: C55.1 DA10.5(CONT)
N$269: DA1.7(.2:B) R88.1 R89.2
N$270: DA1.6(.2:!A) R83.1 R89.1 R90.2
N$271: R87.1 R88.2
N$274: DA1.1(.1:B) R86.1 R87.2 R101.1
N$278: VD38.C VD39.C
N$279: DA2.5(.2:A) R78.2 VD38.A
N$280: DA2.2(.1:!A) R84.2
N$281: DA2.7(.2:B) R93.1 R94.2
N$282: DA2.6(.2:!A) R84.1 R94.1 R95.2
N$283: R92.1 R93.2
N$284: DA2.1(.1:B) R91.1 R92.2 R102.1
N$285: C32.2 DA5.3(.1:IN-) R102.2
N$286: C35.1 DA5.2(.1:IN+) R105.1 R109.1 R110.1
N$287: DA5.7(.1:C_OUT) DA8.2(.1:D) DA8.9(.2:!D) R109.2 R114.2
N$288: C45.2 DA8.15(.1:R/C) R119.1
N$289: C45.1 DA8.14(.1:C)
N$290: C46.2 DA8.7(.2:R/C) R120.1
N$291: DA8.4(.1:!Q) DD3.3(.2:A)
N$292: DA8.12(.2:!Q) DD3.4(.2:B)
N$293: C46.1 DA8.6(.2:C)
N$294: VD46.C VD47.C
N$295: DA3.3(.1:A) R82.2 VD47.A
N$296: VD40.C VD41.C
N$297: DA3.5(.2:A) R79.2 VD40.A
N$298: DA3.2(.1:!A) R85.2
N$299: DA3.7(.2:B) R98.1 R99.2
N$300: DA3.6(.2:!A) R85.1 R99.1 R100.2
N$301: R97.1 R98.2
N$302: DA3.1(.1:B) R96.1 R97.2 R103.1
N$303: C33.2 DA6.3(.1:IN-) R103.2
N$304: C36.1 DA6.2(.1:IN+) R106.1 R111.1 R112.1
N$305: DA6.7(.1:C_OUT) DA9.2(.1:D) DA9.9(.2:!D) R111.2 R115.2
N$306: C47.2 DA9.15(.1:R/C) R121.1
N$307: C47.1 DA9.14(.1:C)
N$308: C48.2 DA9.7(.2:R/C) R122.1
N$309: DA9.4(.1:!Q) DD3.5(.2:C)
N$310: DA9.12(.2:!Q) DD3.13(.1:C)
N$311: C48.1 DA9.6(.2:C)
N$312: R108.2 R110.2 R112.2 R116.2(S)
N$313: C54.2 R125.1 R127.1 VD49.A1
N$347: R126.2 R128.2 VD51.C Z38.1
N$348: R127.2 R129.2 VD52.C Z39.1
N$349: R130.2 VD50.C Z40.1
PHASE_1: R74.2 R77.1 R80.1 XP5.2
PHASE_2: R75.2 R78.1 R81.1 XP5.4
PHASE_3: R76.2 R79.1 R82.1 XP5.6
SPEEDOMETER: Z40.3 ; also sheet 1
TACHO_RAW: R124.2 XP5.1
TACHOMETER: Z38.3 ; also sheet 1
Unconnected: DA4.5(.1:BAL) DA4.6(.1:BALSTR) DA5.5(.1:BAL) DA5.6(.1:BALSTR) DA6.5(.1:BAL) DA6.6(.1:BALSTR) DA7.5(.2:Q) DA7.13(.1:Q) DA8.5(.2:Q) DA8.13(.1:Q) DA9.5(.2:Q) DA9.13(.1:Q) XP5.5 XP5.7 XP5.8

### Buses
TACHOMETER,FREQMETER,SPEEDOMETER,USB_DISCOVERY,USB_PRESENT

### Notes on the sheet
- C(1)
- C(10)

## Sheet 4 of 11: power
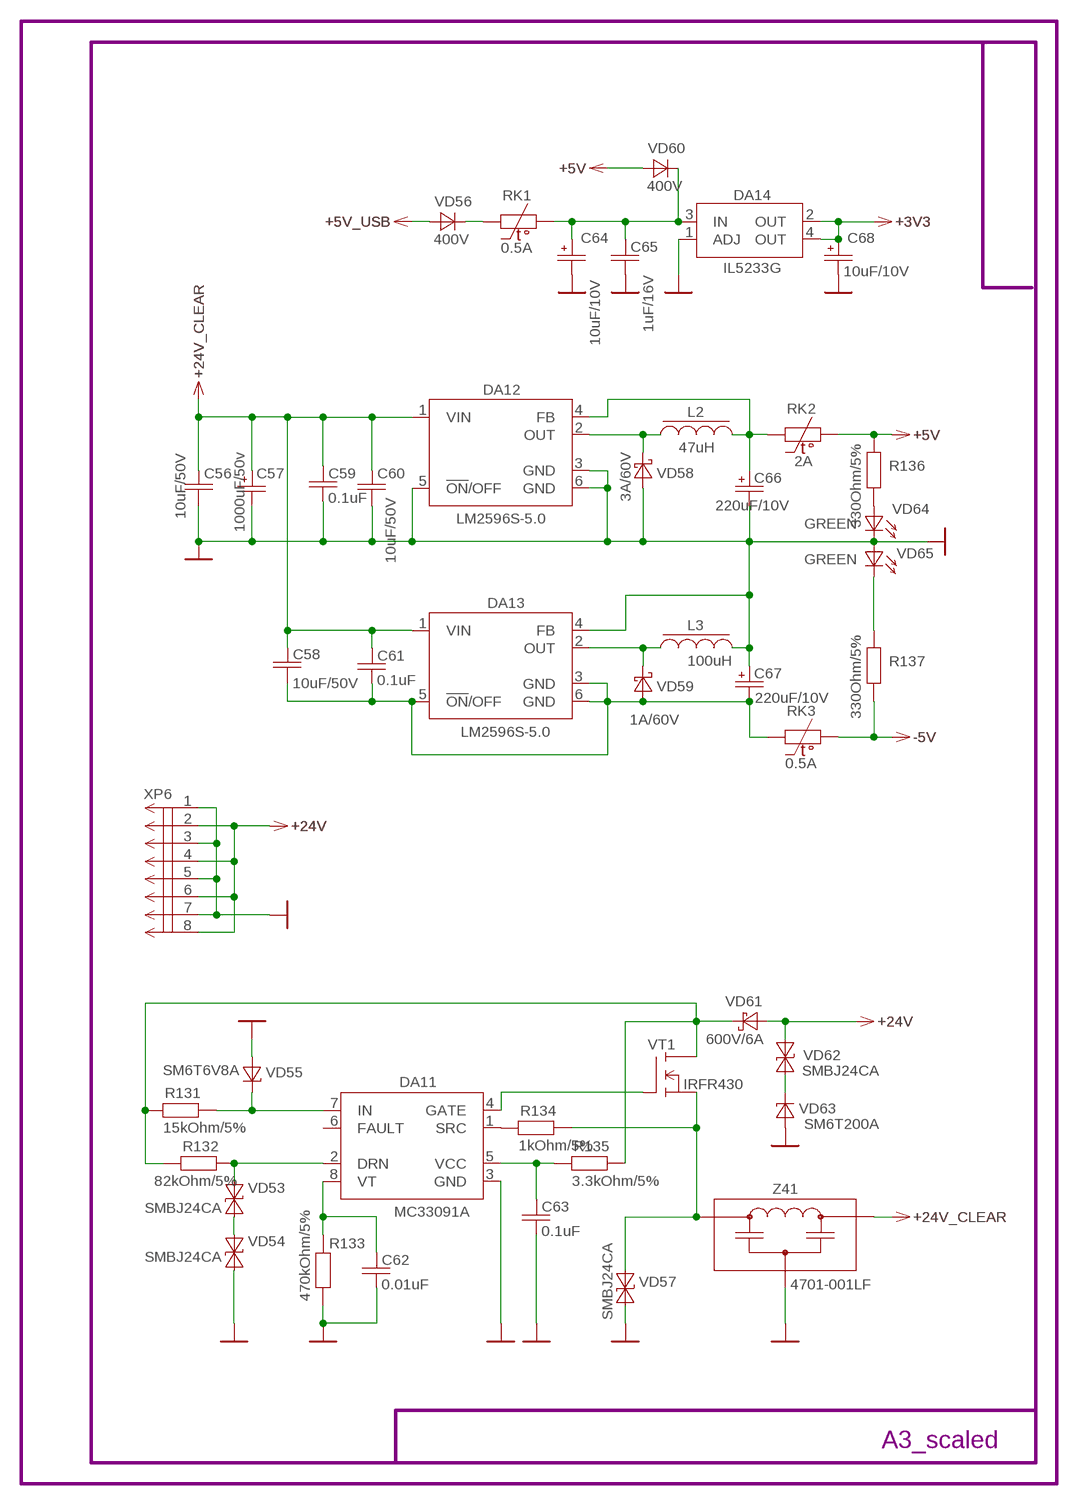
[diagram p3: schematic, sheet 4]

### Parts
C56  10uF/50V  C-EUC2220K  [C2220K]
C57  1000uF/50v  CPOL-EUE35-16AXIAL-STRAPPED  [E35-16-STRAPPED]
C58  10uF/50V  C-EUC2220K  [C2220K]
C59  0.1uF  C-EUC0603  [C0603]
C60  10uF/50V  C-EUC2220K  [C2220K]
C61  0.1uF  C-EUC0603  [C0603]
C62  0.01uF  C-EUC0603  [C0603]
C63  0.1uF  C-EUC0603  [C0603]
C64  10uF/10V  CPOL-EUA/3216-18W  [A/3216-18W]
C65  1uF/16V  C-EUC0603  [C0603]
C66  220uF/10V  CPOL-EUTE-D-7343  [TE-D-7343]
C67  220uF/10V  CPOL-EUTE-D-7343  [TE-D-7343]
C68  10uF/10V  CPOL-EUA/3216-18W  [A/3216-18W]
DA11  MC33091A  [SO08]
DA12  LM2596S-5.0  [TO263-5]
DA13  LM2596S-5.0  [TO263-5]
DA14  IL5233G  [SOT223]
L2  47uH  DRA127  [DRA127]
L3  100uH  DRA73  [DRA73]
R131  15kOhm/5%  R-EU_R0805  [R0805]
R132  82kOhm/5%  R-EU_R0805  [R0805]
R133  470kOhm/5%  R-EU_R0805  [R0805]
R134  1kOhm/5%  R-EU_R0805  [R0805]
R135  3.3kOhm/5%  R-EU_R2512  [R2512]
R136  330Ohm/5%  R-EU_R0603  [R0603]
R137  330Ohm/5%  R-EU_R0603  [R0603]
RK1  0.5A  RESETTABLE_FUSE_1210  [RK1210]
RK2  2A  RESETTABLE_FUSE_1812  [RK1812]
RK3  0.5A  RESETTABLE_FUSE_1210  [RK1210]
VD53  SMBJ24CA  DIODE-TVS-BIDIR-SMB  [SMB-BIDIR]
VD54  SMBJ24CA  DIODE-TVS-BIDIR-SMB  [SMB-BIDIR]
VD55  SM6T6V8A  DIODE-TVS-UNIDIR-SMB  [SMB]
VD56  400V  DIODE-STANDARD-SMA  [SMA]
VD57  SMBJ24CA  DIODE-TVS-BIDIR-SMB  [SMB-BIDIR]
VD58  3A/60V  DIODE-SCHOTTKY-SMC  [SMC]
VD59  1A/60V  DIODE-SCHOTTKY-SMB  [SMB]
VD60  400V  DIODE-STANDARD-SMA  [SMA]
VD61  600V/6A  IDD06SG60C  [DPAK]
VD62  SMBJ24CA  DIODE-TVS-BIDIR-SMB  [SMB-BIDIR]
VD63  SM6T200A  DIODE-TVS-UNIDIR-SMB  [SMB]
VD64  GREEN  LED0805  [LED-0805]
VD65  GREEN  LED0805  [LED-0805]
VT1  IRFR430  [DPAK]
XP6  MOLEX-90130-08  [MOLEX-90130-08]
Z41  4701-001LF  [TUSONIX-4701]

### Nets
+3V3: C68.+ DA14.2(OUT) DA14.4(OUT) ; also sheet 1,5,6,7,8,9,10
+5V: R136.1 RK2.2 VD60.A ; also sheet 3
+5V_USB: VD56.A ; also sheet 10
+24V: VD61.3(A) VD62.A1 XP6.2 XP6.4 XP6.6 XP6.8
+24V_CLEAR: C56.2 C57.+ C58.2 C59.1 C60.2 C61.1 DA12.1(VIN) DA13.1(VIN) Z41.3 ; also sheet 2,5
-5V: R137.2 RK3.2 ; also sheet 3
GND: C56.1 C57.- C59.2 C60.1 C62.2 C63.2 C64.- C65.2 C66.- C67.+ C68.- DA11.3(GND) DA12.3(GND) DA12.5(!ON!/OFF) DA12.6(GND) DA13.4(FB) DA14.1(ADJ) L3.2 R133.1 VD54.A1 VD55.A VD57.A2 VD58.A VD63.A VD64.C VD65.A XP6.1 XP6.3 XP6.5 XP6.7 Z41.2 ; also sheet 1,2,3,5,6,7,8,9,10
N$2: DA12.2(OUT) L2.1 VD58.C
N$7: DA13.2(OUT) L3.1 VD59.C
N$21: C63.1 DA11.5(VCC) R135.1
N$22: VD62.A2 VD63.C
N$23: VD53.A1 VD54.A2
N$24: DA11.2(DRN) R132.2 VD53.A2
N$25: DA11.7(IN) R131.2 VD55.C
N$26: R131.1 R132.1 R135.2 VD61.2(C) VT1.2(D)
N$27: DA11.1(SRC) R134.1
N$28: C62.1 DA11.8(VT) R133.2
N$29: DA11.4(GATE) VT1.1(G)
N$85: C66.+ DA12.4(FB) L2.2 RK2.1
N$86: C58.1 C61.2 C67.- DA13.3(GND) DA13.5(!ON!/OFF) DA13.6(GND) RK3.1 VD59.A
N$225: RK1.1 VD56.C
N$234: C64.+ C65.1 DA14.3(IN) RK1.2 VD60.C
N$244: R134.2 VD57.A1 VT1.3(S) Z41.1
N$266: R136.2 VD64.A
N$267: R137.1 VD65.C
Unconnected: DA11.6(FAULT)

## Sheet 5 of 11: rel1
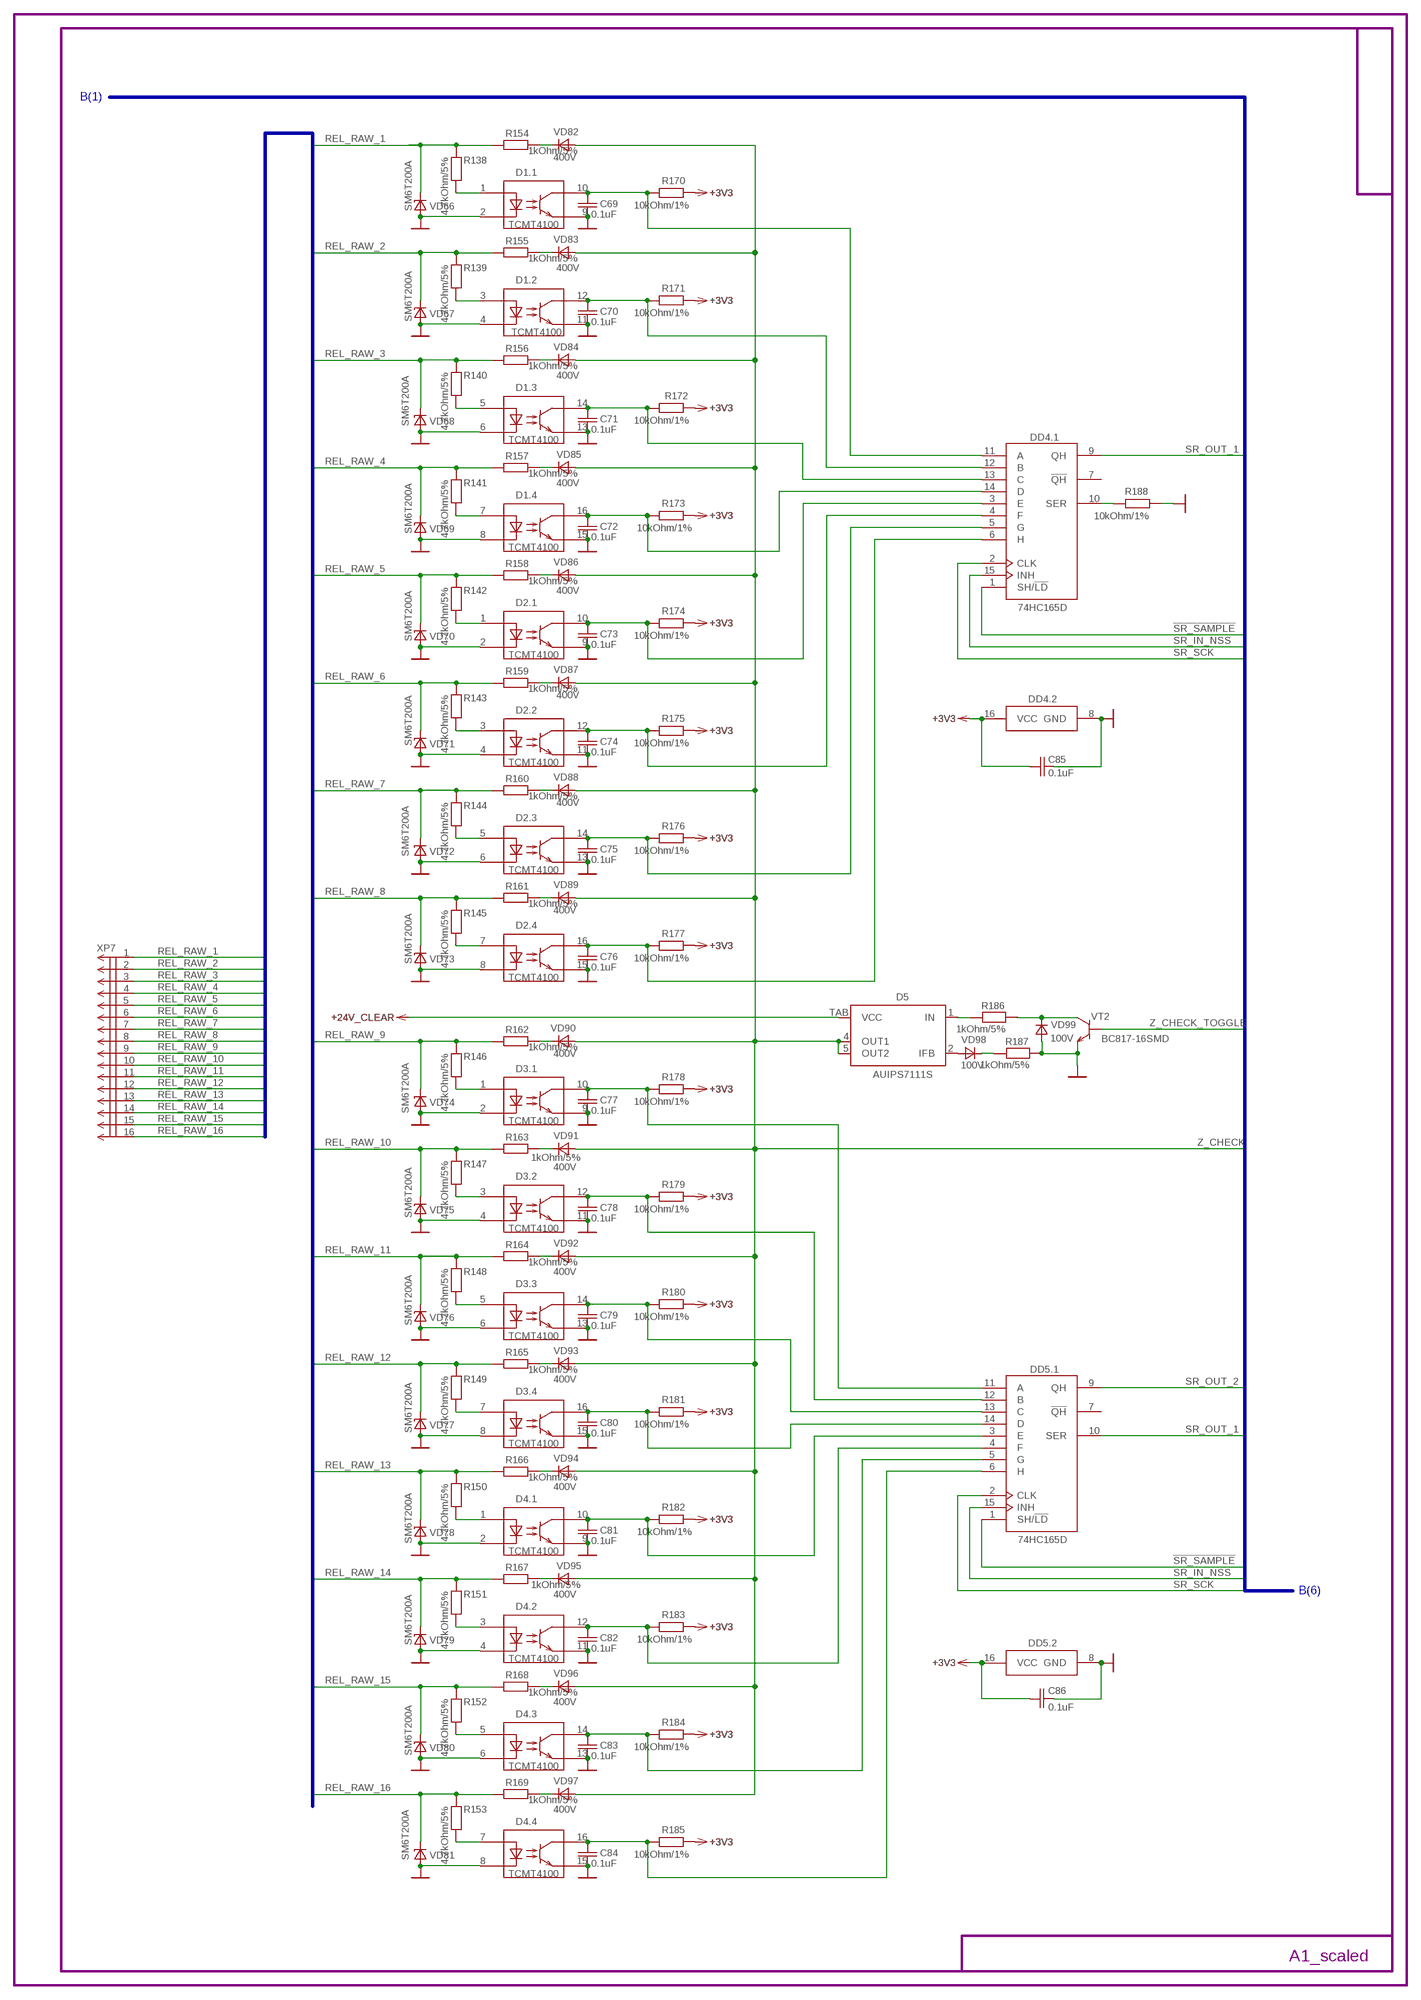
[diagram p4: schematic, sheet 5]

### Parts
C69  0.1uF  C-EUC0603  [C0603]
C70  0.1uF  C-EUC0603  [C0603]
C71  0.1uF  C-EUC0603  [C0603]
C72  0.1uF  C-EUC0603  [C0603]
C73  0.1uF  C-EUC0603  [C0603]
C74  0.1uF  C-EUC0603  [C0603]
C75  0.1uF  C-EUC0603  [C0603]
C76  0.1uF  C-EUC0603  [C0603]
C77  0.1uF  C-EUC0603  [C0603]
C78  0.1uF  C-EUC0603  [C0603]
C79  0.1uF  C-EUC0603  [C0603]
C80  0.1uF  C-EUC0603  [C0603]
C81  0.1uF  C-EUC0603  [C0603]
C82  0.1uF  C-EUC0603  [C0603]
C83  0.1uF  C-EUC0603  [C0603]
C84  0.1uF  C-EUC0603  [C0603]
C85  0.1uF  C-EUC0603  [C0603]
C86  0.1uF  C-EUC0603  [C0603]
D1  TCMT4100  [SO16]
D2  TCMT4100  [SO16]
D3  TCMT4100  [SO16]
D4  TCMT4100  [SO16]
D5  AUIPS7111S  [TO252-5-11]
DD4  74HC165D  [SO16]
DD5  74HC165D  [SO16]
R138  4.7kOhm/5%  R-EU_R1206  [R1206]
R139  4.7kOhm/5%  R-EU_R1206  [R1206]
R140  4.7kOhm/5%  R-EU_R1206  [R1206]
R141  4.7kOhm/5%  R-EU_R1206  [R1206]
R142  4.7kOhm/5%  R-EU_R1206  [R1206]
R143  4.7kOhm/5%  R-EU_R1206  [R1206]
R144  4.7kOhm/5%  R-EU_R1206  [R1206]
R145  4.7kOhm/5%  R-EU_R1206  [R1206]
R146  4.7kOhm/5%  R-EU_R1206  [R1206]
R147  4.7kOhm/5%  R-EU_R1206  [R1206]
R148  4.7kOhm/5%  R-EU_R1206  [R1206]
R149  4.7kOhm/5%  R-EU_R1206  [R1206]
R150  4.7kOhm/5%  R-EU_R1206  [R1206]
R151  4.7kOhm/5%  R-EU_R1206  [R1206]
R152  4.7kOhm/5%  R-EU_R1206  [R1206]
R153  4.7kOhm/5%  R-EU_R1206  [R1206]
R154  1kOhm/5%  R-EU_R2512  [R2512]
R155  1kOhm/5%  R-EU_R2512  [R2512]
R156  1kOhm/5%  R-EU_R2512  [R2512]
R157  1kOhm/5%  R-EU_R2512  [R2512]
R158  1kOhm/5%  R-EU_R2512  [R2512]
R159  1kOhm/5%  R-EU_R2512  [R2512]
R160  1kOhm/5%  R-EU_R2512  [R2512]
R161  1kOhm/5%  R-EU_R2512  [R2512]
R162  1kOhm/5%  R-EU_R2512  [R2512]
R163  1kOhm/5%  R-EU_R2512  [R2512]
R164  1kOhm/5%  R-EU_R2512  [R2512]
R165  1kOhm/5%  R-EU_R2512  [R2512]
R166  1kOhm/5%  R-EU_R2512  [R2512]
R167  1kOhm/5%  R-EU_R2512  [R2512]
R168  1kOhm/5%  R-EU_R2512  [R2512]
R169  1kOhm/5%  R-EU_R2512  [R2512]
R170  10kOhm/1%  R-EU_R0603  [R0603]
R171  10kOhm/1%  R-EU_R0603  [R0603]
R172  10kOhm/1%  R-EU_R0603  [R0603]
R173  10kOhm/1%  R-EU_R0603  [R0603]
R174  10kOhm/1%  R-EU_R0603  [R0603]
R175  10kOhm/1%  R-EU_R0603  [R0603]
R176  10kOhm/1%  R-EU_R0603  [R0603]
R177  10kOhm/1%  R-EU_R0603  [R0603]
R178  10kOhm/1%  R-EU_R0603  [R0603]
R179  10kOhm/1%  R-EU_R0603  [R0603]
R180  10kOhm/1%  R-EU_R0603  [R0603]
R181  10kOhm/1%  R-EU_R0603  [R0603]
R182  10kOhm/1%  R-EU_R0603  [R0603]
R183  10kOhm/1%  R-EU_R0603  [R0603]
R184  10kOhm/1%  R-EU_R0603  [R0603]
R185  10kOhm/1%  R-EU_R0603  [R0603]
R186  1kOhm/5%  R-EU_R0805  [R0805]
R187  1kOhm/5%  R-EU_R0805  [R0805]
R188  10kOhm/1%  R-EU_R0603  [R0603]
VD66  SM6T200A  DIODE-TVS-UNIDIR-SMB  [SMB]
VD67  SM6T200A  DIODE-TVS-UNIDIR-SMB  [SMB]
VD68  SM6T200A  DIODE-TVS-UNIDIR-SMB  [SMB]
VD69  SM6T200A  DIODE-TVS-UNIDIR-SMB  [SMB]
VD70  SM6T200A  DIODE-TVS-UNIDIR-SMB  [SMB]
VD71  SM6T200A  DIODE-TVS-UNIDIR-SMB  [SMB]
VD72  SM6T200A  DIODE-TVS-UNIDIR-SMB  [SMB]
VD73  SM6T200A  DIODE-TVS-UNIDIR-SMB  [SMB]
VD74  SM6T200A  DIODE-TVS-UNIDIR-SMB  [SMB]
VD75  SM6T200A  DIODE-TVS-UNIDIR-SMB  [SMB]
VD76  SM6T200A  DIODE-TVS-UNIDIR-SMB  [SMB]
VD77  SM6T200A  DIODE-TVS-UNIDIR-SMB  [SMB]
VD78  SM6T200A  DIODE-TVS-UNIDIR-SMB  [SMB]
VD79  SM6T200A  DIODE-TVS-UNIDIR-SMB  [SMB]
VD80  SM6T200A  DIODE-TVS-UNIDIR-SMB  [SMB]
VD81  SM6T200A  DIODE-TVS-UNIDIR-SMB  [SMB]
VD82  400V  DIODE-STANDARD-SMA  [SMA]
VD83  400V  DIODE-STANDARD-SMA  [SMA]
VD84  400V  DIODE-STANDARD-SMA  [SMA]
VD85  400V  DIODE-STANDARD-SMA  [SMA]
VD86  400V  DIODE-STANDARD-SMA  [SMA]
VD87  400V  DIODE-STANDARD-SMA  [SMA]
VD88  400V  DIODE-STANDARD-SMA  [SMA]
VD89  400V  DIODE-STANDARD-SMA  [SMA]
VD90  400V  DIODE-STANDARD-SMA  [SMA]
VD91  400V  DIODE-STANDARD-SMA  [SMA]
VD92  400V  DIODE-STANDARD-SMA  [SMA]
VD93  400V  DIODE-STANDARD-SMA  [SMA]
VD94  400V  DIODE-STANDARD-SMA  [SMA]
VD95  400V  DIODE-STANDARD-SMA  [SMA]
VD96  400V  DIODE-STANDARD-SMA  [SMA]
VD97  400V  DIODE-STANDARD-SMA  [SMA]
VD98  100V  DIODE-STANDARD-SOD323  [SOD323]
VD99  100V  DIODE-STANDARD-SOD323  [SOD323]
VT2  BC817-16SMD  [SOT23-BEC]
XP7  MOLEX-90130-16  [MOLEX-90130-16]

### Nets
!SR_SAMPLE: DD4.1(.1:SH/!LD) DD5.1(.1:SH/!LD) ; also sheet 1,6,7,8
+3V3: C85.1 C86.1 DD4.16(.2:VCC) DD5.16(.2:VCC) R170.1 R171.1 R172.1 R173.1 R174.1 R175.1 R176.1 R177.1 R178.1 R179.1 R180.1 R181.1 R182.1 R183.1 R184.1 R185.1 ; also sheet 1,4,6,7,8,9,10
+24V_CLEAR: D5.TAB(VCC) ; also sheet 2,4
DISCRETE_1: C69.1 D1.10(.1:TC) DD4.11(.1:A) R170.2
DISCRETE_2: C70.1 D1.12(.2:TC) DD4.12(.1:B) R171.2
DISCRETE_3: C71.1 D1.14(.3:TC) DD4.13(.1:C) R172.2
DISCRETE_4: C72.1 D1.16(.4:TC) DD4.14(.1:D) R173.2
DISCRETE_5: C73.1 D2.10(.1:TC) DD4.3(.1:E) R174.2
DISCRETE_6: C74.1 D2.12(.2:TC) DD4.4(.1:F) R175.2
DISCRETE_7: C75.1 D2.14(.3:TC) DD4.5(.1:G) R176.2
DISCRETE_8: C76.1 D2.16(.4:TC) DD4.6(.1:H) R177.2
DISCRETE_9: C77.1 D3.10(.1:TC) DD5.11(.1:A) R178.2
DISCRETE_10: C78.1 D3.12(.2:TC) DD5.12(.1:B) R179.2
DISCRETE_11: C79.1 D3.14(.3:TC) DD5.13(.1:C) R180.2
DISCRETE_12: C80.1 D3.16(.4:TC) DD5.14(.1:D) R181.2
DISCRETE_13: C81.1 D4.10(.1:TC) DD5.3(.1:E) R182.2
DISCRETE_14: C82.1 D4.12(.2:TC) DD5.4(.1:F) R183.2
DISCRETE_15: C83.1 D4.14(.3:TC) DD5.5(.1:G) R184.2
DISCRETE_16: C84.1 D4.16(.4:TC) DD5.6(.1:H) R185.2
GND: C69.2 C70.2 C71.2 C72.2 C73.2 C74.2 C75.2 C76.2 C77.2 C78.2 C79.2 C80.2 C81.2 C82.2 C83.2 C84.2 C85.2 C86.2 D1.2(.1:DC) D1.4(.2:DC) D1.6(.3:DC) D1.8(.4:DC) D1.9(.1:TE) D1.11(.2:TE) D1.13(.3:TE) D1.15(.4:TE) D2.2(.1:DC) D2.4(.2:DC) D2.6(.3:DC) D2.8(.4:DC) D2.9(.1:TE) D2.11(.2:TE) D2.13(.3:TE) D2.15(.4:TE) D3.2(.1:DC) D3.4(.2:DC) D3.6(.3:DC) D3.8(.4:DC) D3.9(.1:TE) D3.11(.2:TE) D3.13(.3:TE) D3.15(.4:TE) D4.2(.1:DC) D4.4(.2:DC) D4.6(.3:DC) D4.8(.4:DC) D4.9(.1:TE) D4.11(.2:TE) D4.13(.3:TE) D4.15(.4:TE) DD4.8(.2:GND) DD5.8(.2:GND) R187.1 R188.1 VD66.A VD67.A VD68.A VD69.A VD70.A VD71.A VD72.A VD73.A VD74.A VD75.A VD76.A VD77.A VD78.A VD79.A VD80.A VD81.A VD99.A VT2.E ; also sheet 1,2,3,4,6,7,8,9,10
N$88: D5.1(IN) R186.2
N$89: R186.1 VD99.C VT2.C
N$90: D5.2(IFB) VD98.A
N$92: R187.2 VD98.C
N$188: R154.2 VD82.C
N$189: R155.2 VD83.C
N$190: R156.2 VD84.C
N$191: R157.2 VD85.C
N$192: R158.2 VD86.C
N$193: R159.2 VD87.C
N$194: R160.2 VD88.C
N$195: R161.2 VD89.C
N$196: R162.2 VD90.C
N$197: R163.2 VD91.C
N$198: R164.2 VD92.C
N$199: R165.2 VD93.C
N$200: R166.2 VD94.C
N$201: R167.2 VD95.C
N$202: R168.2 VD96.C
N$203: R169.2 VD97.C
N$204: D1.1(.1:DA) R138.2
N$205: D1.3(.2:DA) R139.2
N$206: D1.5(.3:DA) R140.2
N$207: D1.7(.4:DA) R141.2
N$208: D2.1(.1:DA) R142.2
N$209: D2.3(.2:DA) R143.2
N$210: D2.5(.3:DA) R144.2
N$211: D2.7(.4:DA) R145.2
N$212: D3.1(.1:DA) R146.2
N$213: D3.3(.2:DA) R147.2
N$214: D3.5(.3:DA) R148.2
N$215: D3.7(.4:DA) R149.2
N$216: D4.1(.1:DA) R150.2
N$217: D4.3(.2:DA) R151.2
N$218: D4.5(.3:DA) R152.2
N$219: D4.7(.4:DA) R153.2
N$273: DD4.10(.1:SER) R188.2
REL_RAW_1: R138.1 R154.1 VD66.C XP7.1
REL_RAW_2: R139.1 R155.1 VD67.C XP7.2
REL_RAW_3: R140.1 R156.1 VD68.C XP7.3
REL_RAW_4: R141.1 R157.1 VD69.C XP7.4
REL_RAW_5: R142.1 R158.1 VD70.C XP7.5
REL_RAW_6: R143.1 R159.1 VD71.C XP7.6
REL_RAW_7: R144.1 R160.1 VD72.C XP7.7
REL_RAW_8: R145.1 R161.1 VD73.C XP7.8
REL_RAW_9: R146.1 R162.1 VD74.C XP7.9
REL_RAW_10: R147.1 R163.1 VD75.C XP7.10
REL_RAW_11: R148.1 R164.1 VD76.C XP7.11
REL_RAW_12: R149.1 R165.1 VD77.C XP7.12
REL_RAW_13: R150.1 R166.1 VD78.C XP7.13
REL_RAW_14: R151.1 R167.1 VD79.C XP7.14
REL_RAW_15: R152.1 R168.1 VD80.C XP7.15
REL_RAW_16: R153.1 R169.1 VD81.C XP7.16
SR_IN_NSS: DD4.15(.1:INH) DD5.15(.1:INH) ; also sheet 1,6,7,8
SR_OUT_1: DD4.9(.1:QH) DD5.10(.1:SER)
SR_OUT_2: DD5.9(.1:QH) ; also sheet 6
SR_SCK: DD4.2(.1:CLK) DD5.2(.1:CLK) ; also sheet 1,6,7,8,9
Z_CHECK: D5.4(OUT1) D5.5(OUT2) VD82.A VD83.A VD84.A VD85.A VD86.A VD87.A VD88.A VD89.A VD90.A VD91.A VD92.A VD93.A VD94.A VD95.A VD96.A VD97.A ; also sheet 6,7,8
Z_CHECK_TOGGLE: VT2.B ; also sheet 1
Unconnected: DD4.7(.1:!QH) DD5.7(.1:!QH)

### Buses
IO_EXPAND:SR_MISO,SR_MOSI,SR_SCK,!SR_SAMPLE,SR_IN_NSS,SR_OUT_NSS,!SR_OUT_ENABLE,SR_OUT_[1..7],Z_CHECK_TOGGLE,Z_CHECK
REL_RAW_[1..64]

### Notes on the sheet
- B(1)
- B(6)

## Sheet 6 of 11: rel2
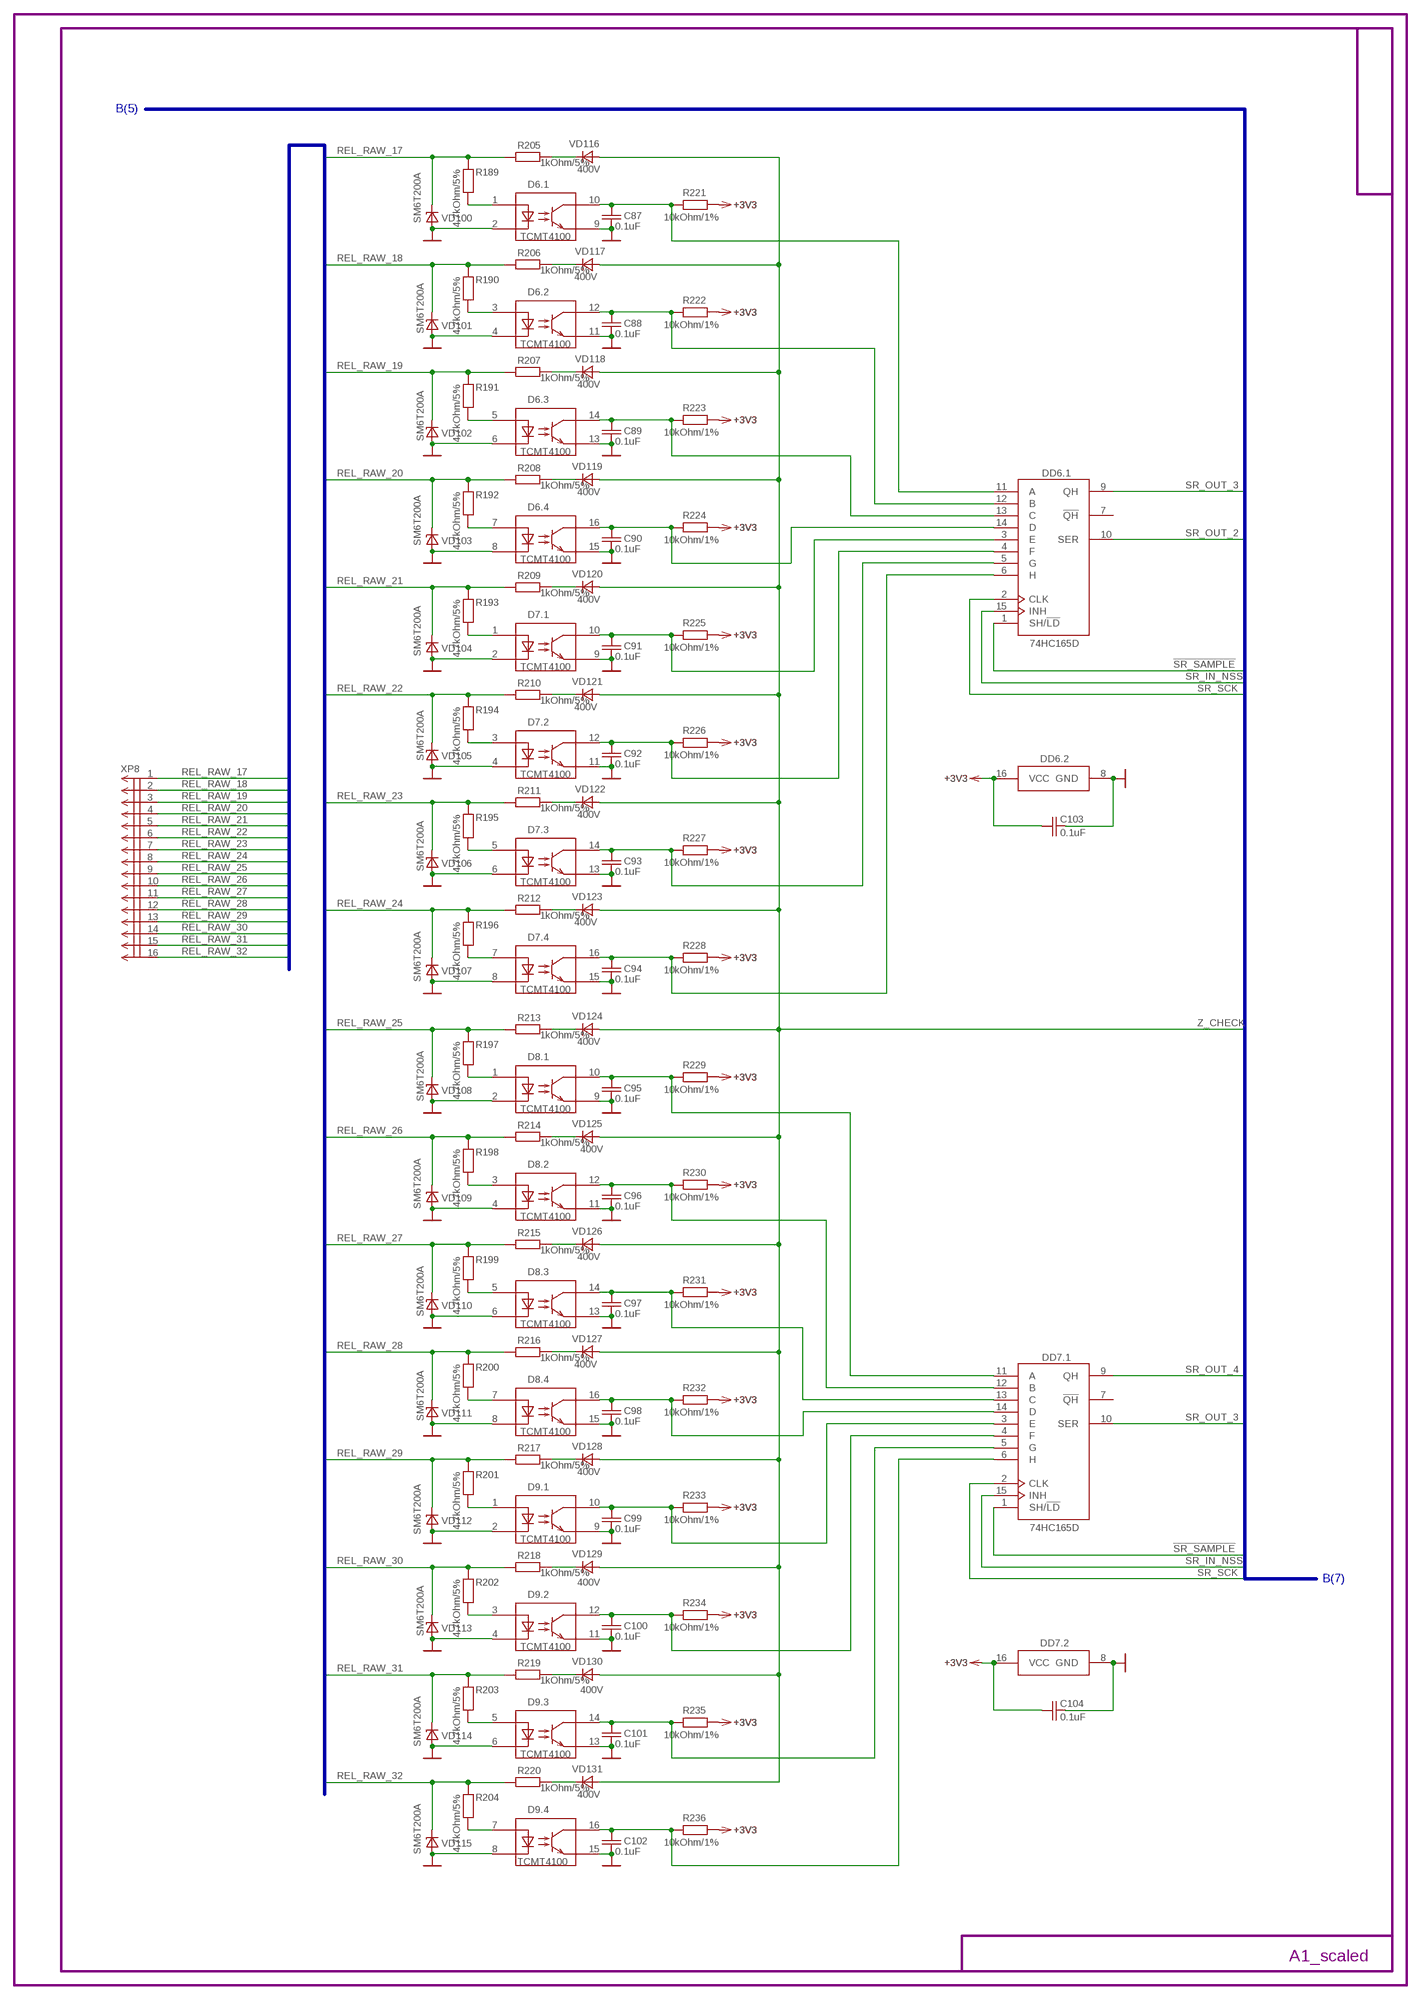
[diagram p5: schematic, sheet 6]

### Parts
C87  0.1uF  C-EUC0603  [C0603]
C88  0.1uF  C-EUC0603  [C0603]
C89  0.1uF  C-EUC0603  [C0603]
C90  0.1uF  C-EUC0603  [C0603]
C91  0.1uF  C-EUC0603  [C0603]
C92  0.1uF  C-EUC0603  [C0603]
C93  0.1uF  C-EUC0603  [C0603]
C94  0.1uF  C-EUC0603  [C0603]
C95  0.1uF  C-EUC0603  [C0603]
C96  0.1uF  C-EUC0603  [C0603]
C97  0.1uF  C-EUC0603  [C0603]
C98  0.1uF  C-EUC0603  [C0603]
C99  0.1uF  C-EUC0603  [C0603]
C100  0.1uF  C-EUC0603  [C0603]
C101  0.1uF  C-EUC0603  [C0603]
C102  0.1uF  C-EUC0603  [C0603]
C103  0.1uF  C-EUC0603  [C0603]
C104  0.1uF  C-EUC0603  [C0603]
D6  TCMT4100  [SO16]
D7  TCMT4100  [SO16]
D8  TCMT4100  [SO16]
D9  TCMT4100  [SO16]
DD6  74HC165D  [SO16]
DD7  74HC165D  [SO16]
R189  4.7kOhm/5%  R-EU_R1206  [R1206]
R190  4.7kOhm/5%  R-EU_R1206  [R1206]
R191  4.7kOhm/5%  R-EU_R1206  [R1206]
R192  4.7kOhm/5%  R-EU_R1206  [R1206]
R193  4.7kOhm/5%  R-EU_R1206  [R1206]
R194  4.7kOhm/5%  R-EU_R1206  [R1206]
R195  4.7kOhm/5%  R-EU_R1206  [R1206]
R196  4.7kOhm/5%  R-EU_R1206  [R1206]
R197  4.7kOhm/5%  R-EU_R1206  [R1206]
R198  4.7kOhm/5%  R-EU_R1206  [R1206]
R199  4.7kOhm/5%  R-EU_R1206  [R1206]
R200  4.7kOhm/5%  R-EU_R1206  [R1206]
R201  4.7kOhm/5%  R-EU_R1206  [R1206]
R202  4.7kOhm/5%  R-EU_R1206  [R1206]
R203  4.7kOhm/5%  R-EU_R1206  [R1206]
R204  4.7kOhm/5%  R-EU_R1206  [R1206]
R205  1kOhm/5%  R-EU_R2512  [R2512]
R206  1kOhm/5%  R-EU_R2512  [R2512]
R207  1kOhm/5%  R-EU_R2512  [R2512]
R208  1kOhm/5%  R-EU_R2512  [R2512]
R209  1kOhm/5%  R-EU_R2512  [R2512]
R210  1kOhm/5%  R-EU_R2512  [R2512]
R211  1kOhm/5%  R-EU_R2512  [R2512]
R212  1kOhm/5%  R-EU_R2512  [R2512]
R213  1kOhm/5%  R-EU_R2512  [R2512]
R214  1kOhm/5%  R-EU_R2512  [R2512]
R215  1kOhm/5%  R-EU_R2512  [R2512]
R216  1kOhm/5%  R-EU_R2512  [R2512]
R217  1kOhm/5%  R-EU_R2512  [R2512]
R218  1kOhm/5%  R-EU_R2512  [R2512]
R219  1kOhm/5%  R-EU_R2512  [R2512]
R220  1kOhm/5%  R-EU_R2512  [R2512]
R221  10kOhm/1%  R-EU_R0603  [R0603]
R222  10kOhm/1%  R-EU_R0603  [R0603]
R223  10kOhm/1%  R-EU_R0603  [R0603]
R224  10kOhm/1%  R-EU_R0603  [R0603]
R225  10kOhm/1%  R-EU_R0603  [R0603]
R226  10kOhm/1%  R-EU_R0603  [R0603]
R227  10kOhm/1%  R-EU_R0603  [R0603]
R228  10kOhm/1%  R-EU_R0603  [R0603]
R229  10kOhm/1%  R-EU_R0603  [R0603]
R230  10kOhm/1%  R-EU_R0603  [R0603]
R231  10kOhm/1%  R-EU_R0603  [R0603]
R232  10kOhm/1%  R-EU_R0603  [R0603]
R233  10kOhm/1%  R-EU_R0603  [R0603]
R234  10kOhm/1%  R-EU_R0603  [R0603]
R235  10kOhm/1%  R-EU_R0603  [R0603]
R236  10kOhm/1%  R-EU_R0603  [R0603]
VD100  SM6T200A  DIODE-TVS-UNIDIR-SMB  [SMB]
VD101  SM6T200A  DIODE-TVS-UNIDIR-SMB  [SMB]
VD102  SM6T200A  DIODE-TVS-UNIDIR-SMB  [SMB]
VD103  SM6T200A  DIODE-TVS-UNIDIR-SMB  [SMB]
VD104  SM6T200A  DIODE-TVS-UNIDIR-SMB  [SMB]
VD105  SM6T200A  DIODE-TVS-UNIDIR-SMB  [SMB]
VD106  SM6T200A  DIODE-TVS-UNIDIR-SMB  [SMB]
VD107  SM6T200A  DIODE-TVS-UNIDIR-SMB  [SMB]
VD108  SM6T200A  DIODE-TVS-UNIDIR-SMB  [SMB]
VD109  SM6T200A  DIODE-TVS-UNIDIR-SMB  [SMB]
VD110  SM6T200A  DIODE-TVS-UNIDIR-SMB  [SMB]
VD111  SM6T200A  DIODE-TVS-UNIDIR-SMB  [SMB]
VD112  SM6T200A  DIODE-TVS-UNIDIR-SMB  [SMB]
VD113  SM6T200A  DIODE-TVS-UNIDIR-SMB  [SMB]
VD114  SM6T200A  DIODE-TVS-UNIDIR-SMB  [SMB]
VD115  SM6T200A  DIODE-TVS-UNIDIR-SMB  [SMB]
VD116  400V  DIODE-STANDARD-SMA  [SMA]
VD117  400V  DIODE-STANDARD-SMA  [SMA]
VD118  400V  DIODE-STANDARD-SMA  [SMA]
VD119  400V  DIODE-STANDARD-SMA  [SMA]
VD120  400V  DIODE-STANDARD-SMA  [SMA]
VD121  400V  DIODE-STANDARD-SMA  [SMA]
VD122  400V  DIODE-STANDARD-SMA  [SMA]
VD123  400V  DIODE-STANDARD-SMA  [SMA]
VD124  400V  DIODE-STANDARD-SMA  [SMA]
VD125  400V  DIODE-STANDARD-SMA  [SMA]
VD126  400V  DIODE-STANDARD-SMA  [SMA]
VD127  400V  DIODE-STANDARD-SMA  [SMA]
VD128  400V  DIODE-STANDARD-SMA  [SMA]
VD129  400V  DIODE-STANDARD-SMA  [SMA]
VD130  400V  DIODE-STANDARD-SMA  [SMA]
VD131  400V  DIODE-STANDARD-SMA  [SMA]
XP8  MOLEX-90130-16  [MOLEX-90130-16]

### Nets
!SR_SAMPLE: DD6.1(.1:SH/!LD) DD7.1(.1:SH/!LD) ; also sheet 1,5,7,8
+3V3: C103.1 C104.1 DD6.16(.2:VCC) DD7.16(.2:VCC) R221.1 R222.1 R223.1 R224.1 R225.1 R226.1 R227.1 R228.1 R229.1 R230.1 R231.1 R232.1 R233.1 R234.1 R235.1 R236.1 ; also sheet 1,4,5,7,8,9,10
DISCRETE_17: C87.1 D6.10(.1:TC) DD6.11(.1:A) R221.2
DISCRETE_18: C88.1 D6.12(.2:TC) DD6.12(.1:B) R222.2
DISCRETE_19: C89.1 D6.14(.3:TC) DD6.13(.1:C) R223.2
DISCRETE_20: C90.1 D6.16(.4:TC) DD6.14(.1:D) R224.2
DISCRETE_21: C91.1 D7.10(.1:TC) DD6.3(.1:E) R225.2
DISCRETE_22: C92.1 D7.12(.2:TC) DD6.4(.1:F) R226.2
DISCRETE_23: C93.1 D7.14(.3:TC) DD6.5(.1:G) R227.2
DISCRETE_24: C94.1 D7.16(.4:TC) DD6.6(.1:H) R228.2
DISCRETE_25: C95.1 D8.10(.1:TC) DD7.11(.1:A) R229.2
DISCRETE_26: C96.1 D8.12(.2:TC) DD7.12(.1:B) R230.2
DISCRETE_27: C97.1 D8.14(.3:TC) DD7.13(.1:C) R231.2
DISCRETE_28: C98.1 D8.16(.4:TC) DD7.14(.1:D) R232.2
DISCRETE_29: C99.1 D9.10(.1:TC) DD7.3(.1:E) R233.2
DISCRETE_30: C100.1 D9.12(.2:TC) DD7.4(.1:F) R234.2
DISCRETE_31: C101.1 D9.14(.3:TC) DD7.5(.1:G) R235.2
DISCRETE_32: C102.1 D9.16(.4:TC) DD7.6(.1:H) R236.2
GND: C87.2 C88.2 C89.2 C90.2 C91.2 C92.2 C93.2 C94.2 C95.2 C96.2 C97.2 C98.2 C99.2 C100.2 C101.2 C102.2 C103.2 C104.2 D6.2(.1:DC) D6.4(.2:DC) D6.6(.3:DC) D6.8(.4:DC) D6.9(.1:TE) D6.11(.2:TE) D6.13(.3:TE) D6.15(.4:TE) D7.2(.1:DC) D7.4(.2:DC) D7.6(.3:DC) D7.8(.4:DC) D7.9(.1:TE) D7.11(.2:TE) D7.13(.3:TE) D7.15(.4:TE) D8.2(.1:DC) D8.4(.2:DC) D8.6(.3:DC) D8.8(.4:DC) D8.9(.1:TE) D8.11(.2:TE) D8.13(.3:TE) D8.15(.4:TE) D9.2(.1:DC) D9.4(.2:DC) D9.6(.3:DC) D9.8(.4:DC) D9.9(.1:TE) D9.11(.2:TE) D9.13(.3:TE) D9.15(.4:TE) DD6.8(.2:GND) DD7.8(.2:GND) VD100.A VD101.A VD102.A VD103.A VD104.A VD105.A VD106.A VD107.A VD108.A VD109.A VD110.A VD111.A VD112.A VD113.A VD114.A VD115.A ; also sheet 1,2,3,4,5,7,8,9,10
N$156: R205.2 VD116.C
N$157: R206.2 VD117.C
N$158: R207.2 VD118.C
N$159: R208.2 VD119.C
N$160: R209.2 VD120.C
N$161: R210.2 VD121.C
N$162: R211.2 VD122.C
N$163: R212.2 VD123.C
N$164: R213.2 VD124.C
N$165: R214.2 VD125.C
N$166: R215.2 VD126.C
N$167: R216.2 VD127.C
N$168: R217.2 VD128.C
N$169: R218.2 VD129.C
N$170: R219.2 VD130.C
N$171: R220.2 VD131.C
N$172: D6.1(.1:DA) R189.2
N$173: D6.3(.2:DA) R190.2
N$174: D6.5(.3:DA) R191.2
N$175: D6.7(.4:DA) R192.2
N$176: D7.1(.1:DA) R193.2
N$177: D7.3(.2:DA) R194.2
N$178: D7.5(.3:DA) R195.2
N$179: D7.7(.4:DA) R196.2
N$180: D8.1(.1:DA) R197.2
N$181: D8.3(.2:DA) R198.2
N$182: D8.5(.3:DA) R199.2
N$183: D8.7(.4:DA) R200.2
N$184: D9.1(.1:DA) R201.2
N$185: D9.3(.2:DA) R202.2
N$186: D9.5(.3:DA) R203.2
N$187: D9.7(.4:DA) R204.2
REL_RAW_17: R189.1 R205.1 VD100.C XP8.1
REL_RAW_18: R190.1 R206.1 VD101.C XP8.2
REL_RAW_19: R191.1 R207.1 VD102.C XP8.3
REL_RAW_20: R192.1 R208.1 VD103.C XP8.4
REL_RAW_21: R193.1 R209.1 VD104.C XP8.5
REL_RAW_22: R194.1 R210.1 VD105.C XP8.6
REL_RAW_23: R195.1 R211.1 VD106.C XP8.7
REL_RAW_24: R196.1 R212.1 VD107.C XP8.8
REL_RAW_25: R197.1 R213.1 VD108.C XP8.9
REL_RAW_26: R198.1 R214.1 VD109.C XP8.10
REL_RAW_27: R199.1 R215.1 VD110.C XP8.11
REL_RAW_28: R200.1 R216.1 VD111.C XP8.12
REL_RAW_29: R201.1 R217.1 VD112.C XP8.13
REL_RAW_30: R202.1 R218.1 VD113.C XP8.14
REL_RAW_31: R203.1 R219.1 VD114.C XP8.15
REL_RAW_32: R204.1 R220.1 VD115.C XP8.16
SR_IN_NSS: DD6.15(.1:INH) DD7.15(.1:INH) ; also sheet 1,5,7,8
SR_OUT_2: DD6.10(.1:SER) ; also sheet 5
SR_OUT_3: DD6.9(.1:QH) DD7.10(.1:SER)
SR_OUT_4: DD7.9(.1:QH) ; also sheet 7
SR_SCK: DD6.2(.1:CLK) DD7.2(.1:CLK) ; also sheet 1,5,7,8,9
Z_CHECK: VD116.A VD117.A VD118.A VD119.A VD120.A VD121.A VD122.A VD123.A VD124.A VD125.A VD126.A VD127.A VD128.A VD129.A VD130.A VD131.A ; also sheet 5,7,8
Unconnected: DD6.7(.1:!QH) DD7.7(.1:!QH)

### Buses
IO_EXPAND:SR_MISO,SR_MOSI,SR_SCK,!SR_SAMPLE,SR_IN_NSS,SR_OUT_NSS,!SR_OUT_ENABLE,SR_OUT_[1..7],Z_CHECK_TOGGLE,Z_CHECK
REL_RAW_[1..64]

### Notes on the sheet
- B(5)
- B(7)